# Altium project AMS_A2_Sample.PrjPcb
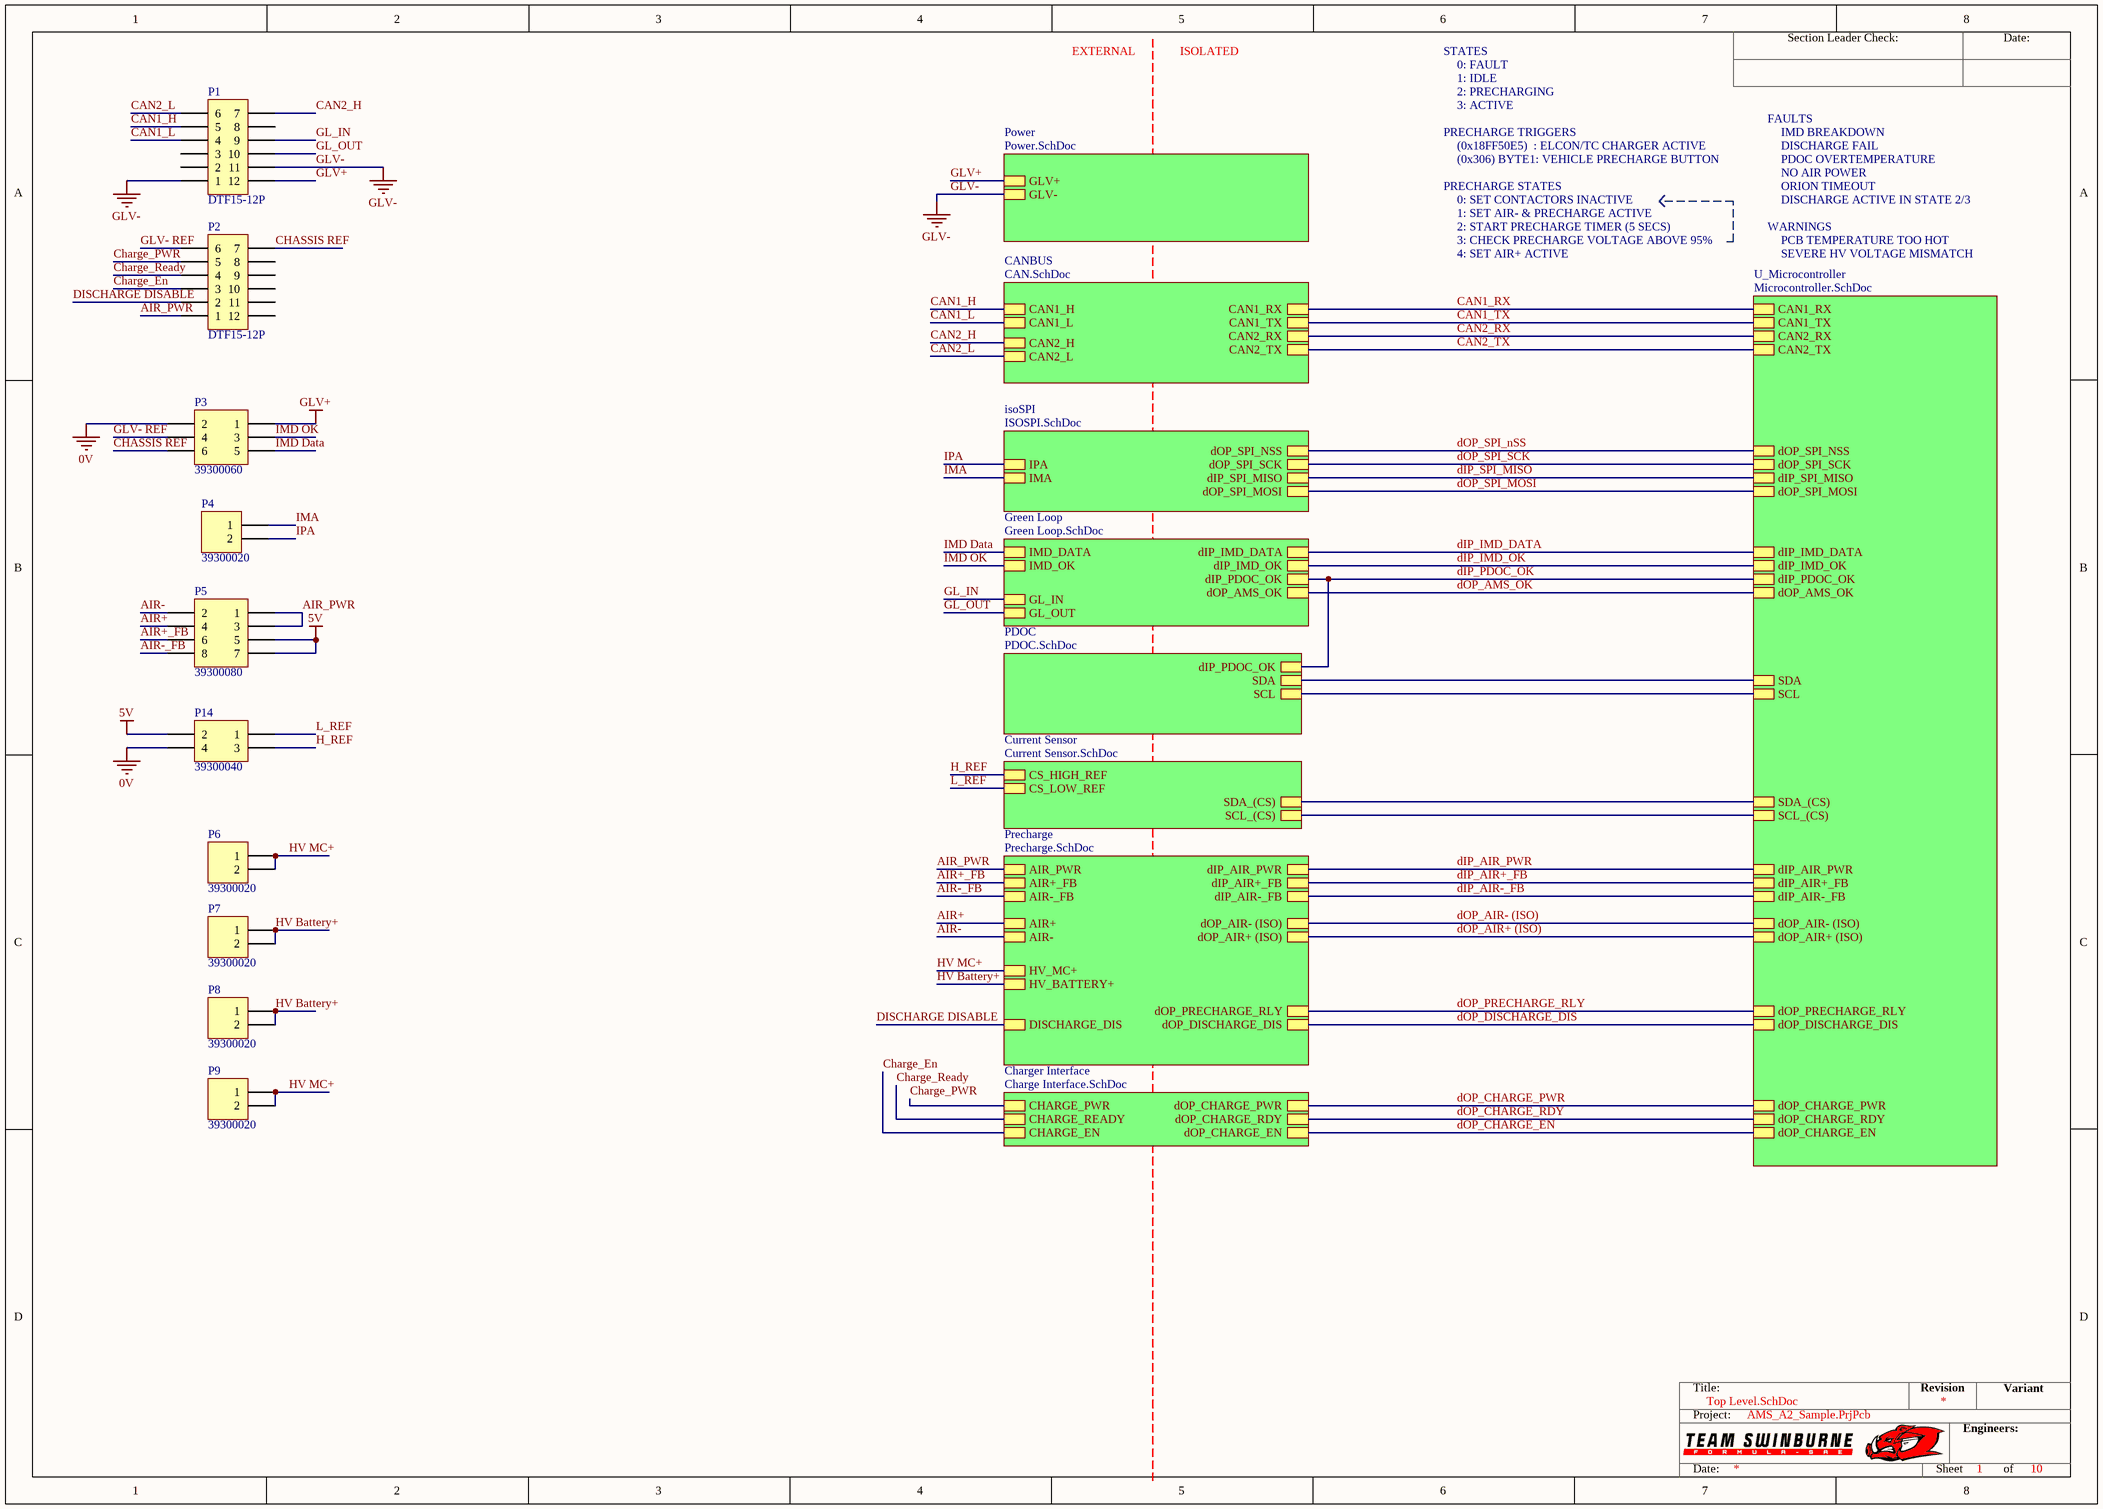
[diagram p0: Top Level.SchDoc]
7 sheets, 159 parts. Net scope: hierarchical (ports join the sheet entries above them; power ports are global).
Board file: AMS_A2_Sample.PcbDoc
Sheets:
  Top Level.SchDoc
    U_Microcontroller = Microcontroller.SchDoc
    PDOC = PDOC.SchDoc
    Precharge = Precharge.SchDoc
    Charger Interface = Charge Interface.SchDoc
    Current Sensor = Current Sensor.SchDoc
    Power = Power.SchDoc

## Sheet Top Level.SchDoc
size A3; SheetNumber: 1; SheetTotal: 10

### Parts
P1  DTF15-12P  [DTF15-12P]
P2  DTF15-12P  [DTF15-12P]
P3  39300060  [39300060]
P4  39300020  [39300020]
P5  39300080  [39300080]
P6  39300020  [39300020]
P7  39300020  [39300020]
P8  39300020  [39300020]
P9  39300020  [39300020]
P14  39300040  [39300040]

### Sub-sheets
CANBUS = CAN.SchDoc (file not in this document): CAN1_RX, CAN1_TX, CAN2_RX, CAN2_TX, CAN1_H, CAN1_L, CAN2_H, CAN2_L
Charger Interface = Charge Interface.SchDoc: dOP_CHARGE_PWR, dOP_CHARGE_RDY, dOP_CHARGE_EN, CHARGE_PWR, CHARGE_READY, CHARGE_EN
Current Sensor = Current Sensor.SchDoc: SCL_(CS), CS_HIGH_REF, CS_LOW_REF, SDA_(CS)
Green Loop = Green Loop.SchDoc (file not in this document): dIP_IMD_DATA, dIP_IMD_OK, dIP_PDOC_OK, dOP_AMS_OK, IMD_DATA, IMD_OK, GL_IN, GL_OUT
isoSPI = ISOSPI.SchDoc (file not in this document): dOP_SPI_NSS, dOP_SPI_SCK, dIP_SPI_MISO, dOP_SPI_MOSI, IPA, IMA
PDOC = PDOC.SchDoc: dIP_PDOC_OK, SDA, SCL
Power = Power.SchDoc: GLV+, GLV-
Precharge = Precharge.SchDoc: dIP_AIR_PWR, dIP_AIR+_FB, dIP_AIR-_FB, dOP_AIR- (ISO), dOP_AIR+ (ISO), dOP_PRECHARGE_RLY, dOP_DISCHARGE_DIS, DISCHARGE_DIS, AIR+, AIR-, AIR_PWR, AIR+_FB, AIR-_FB, HV_MC+, HV_BATTERY+
U_Microcontroller = Microcontroller.SchDoc: CAN1_RX, CAN1_TX, dOP_SPI_NSS, CAN2_RX, CAN2_TX, dOP_SPI_SCK, dIP_SPI_MISO, dOP_SPI_MOSI, dIP_IMD_DATA, dIP_IMD_OK, dIP_PDOC_OK, dOP_AMS_OK, dIP_AIR_PWR, dIP_AIR+_FB, dIP_AIR-_FB, dOP_AIR- (ISO), dOP_AIR+ (ISO), dOP_PRECHARGE_RLY, dOP_DISCHARGE_DIS, dOP_CHARGE_PWR, dOP_CHARGE_RDY, dOP_CHARGE_EN, SDA, SCL, SDA_(CS), SCL_(CS)

### Nets
0V: P3.2 P14.4
5V: P5.5 P5.7 P14.2
GLV+: P1.12 P3.1 ; sheet Power/GLV+
GLV-: P1.1 P1.11 ; sheet Power/GLV-
AIR+: P5.4 ; sheet Precharge/AIR+
AIR+_FB: P5.6 ; sheet Precharge/AIR+_FB
AIR-: P5.2 ; sheet Precharge/AIR-
AIR-_FB: P5.8 ; sheet Precharge/AIR-_FB
AIR_PWR: P2.1 P5.1 P5.3 ; sheet Precharge/AIR_PWR
CAN1_H: P1.5 ; sheet CANBUS/CAN1_H
CAN1_L: P1.4 ; sheet CANBUS/CAN1_L
CAN1_RX: sheet U_Microcontroller/CAN1_RX, sheet CANBUS/CAN1_RX
CAN1_TX: sheet U_Microcontroller/CAN1_TX, sheet CANBUS/CAN1_TX
CAN2_H: P1.7 ; sheet CANBUS/CAN2_H
CAN2_L: P1.6 ; sheet CANBUS/CAN2_L
CAN2_RX: sheet U_Microcontroller/CAN2_RX, sheet CANBUS/CAN2_RX
CAN2_TX: sheet U_Microcontroller/CAN2_TX, sheet CANBUS/CAN2_TX
Charge_En: P2.3 ; sheet Charger Interface/CHARGE_EN
Charge_PWR: P2.5 ; sheet Charger Interface/CHARGE_PWR
Charge_Ready: P2.4 ; sheet Charger Interface/CHARGE_READY
CHASSIS REF: P2.7 P3.6
dIP_AIR+_FB: sheet U_Microcontroller/dIP_AIR+_FB, sheet Precharge/dIP_AIR+_FB
dIP_AIR-_FB: sheet U_Microcontroller/dIP_AIR-_FB, sheet Precharge/dIP_AIR-_FB
dIP_AIR_PWR: sheet U_Microcontroller/dIP_AIR_PWR, sheet Precharge/dIP_AIR_PWR
dIP_IMD_DATA: sheet U_Microcontroller/dIP_IMD_DATA, sheet Green Loop/dIP_IMD_DATA
dIP_IMD_OK: sheet U_Microcontroller/dIP_IMD_OK, sheet Green Loop/dIP_IMD_OK
dIP_PDOC_OK: sheet U_Microcontroller/dIP_PDOC_OK, sheet Green Loop/dIP_PDOC_OK, sheet PDOC/dIP_PDOC_OK
dIP_SPI_MISO: sheet U_Microcontroller/dIP_SPI_MISO, sheet isoSPI/dIP_SPI_MISO
DISCHARGE DISABLE: P2.2 ; sheet Precharge/DISCHARGE_DIS
dOP_AIR+ (ISO): sheet U_Microcontroller/dOP_AIR+ (ISO), sheet Precharge/dOP_AIR+ (ISO)
dOP_AIR- (ISO): sheet U_Microcontroller/dOP_AIR- (ISO), sheet Precharge/dOP_AIR- (ISO)
dOP_AMS_OK: sheet U_Microcontroller/dOP_AMS_OK, sheet Green Loop/dOP_AMS_OK
dOP_CHARGE_EN: sheet U_Microcontroller/dOP_CHARGE_EN, sheet Charger Interface/dOP_CHARGE_EN
dOP_CHARGE_PWR: sheet U_Microcontroller/dOP_CHARGE_PWR, sheet Charger Interface/dOP_CHARGE_PWR
dOP_CHARGE_RDY: sheet U_Microcontroller/dOP_CHARGE_RDY, sheet Charger Interface/dOP_CHARGE_RDY
dOP_DISCHARGE_DIS: sheet U_Microcontroller/dOP_DISCHARGE_DIS, sheet Precharge/dOP_DISCHARGE_DIS
dOP_PRECHARGE_RLY: sheet U_Microcontroller/dOP_PRECHARGE_RLY, sheet Precharge/dOP_PRECHARGE_RLY
dOP_SPI_MOSI: sheet U_Microcontroller/dOP_SPI_MOSI, sheet isoSPI/dOP_SPI_MOSI
dOP_SPI_nSS: sheet U_Microcontroller/dOP_SPI_NSS, sheet isoSPI/dOP_SPI_NSS
dOP_SPI_SCK: sheet U_Microcontroller/dOP_SPI_SCK, sheet isoSPI/dOP_SPI_SCK
GL_IN: P1.9 ; sheet Green Loop/GL_IN
GL_OUT: P1.10 ; sheet Green Loop/GL_OUT
GLV- REF: P2.6 P3.4
H_REF: P14.3 ; sheet Current Sensor/CS_HIGH_REF
HV Battery+: P7.1 P7.2 P8.1 P8.2 ; sheet Precharge/HV_BATTERY+
HV MC+: P6.1 P6.2 P9.1 P9.2 ; sheet Precharge/HV_MC+
I2C1_SCL: sheet U_Microcontroller/SCL, sheet PDOC/SCL
I2C1_SDA: sheet U_Microcontroller/SDA, sheet PDOC/SDA
I2C3_SCL: sheet U_Microcontroller/SCL_(CS), sheet Current Sensor/SCL_(CS)
I2C3_SDA: sheet U_Microcontroller/SDA_(CS), sheet Current Sensor/SDA_(CS)
IMA: P4.1 ; sheet isoSPI/IMA
IMD Data: P3.5 ; sheet Green Loop/IMD_DATA
IMD OK: P3.3 ; sheet Green Loop/IMD_OK
IPA: P4.2 ; sheet isoSPI/IPA
L_REF: P14.1 ; sheet Current Sensor/CS_LOW_REF

Not connected (* = marked no-connect by the designer): P1 2 3 8; P2 8 9 10 11 12

### Notes on the sheet
- EXTERNAL
- ISOLATED
- STATES
- 0: FAULT
- 1: IDLE
- 2: PRECHARGING
- 3: ACTIVE
- PRECHARGE TRIGGERS
- (0x18FF50E5)  : ELCON/TC CHARGER ACTIVE
- (0x306) BYTE1: VEHICLE PRECHARGE BUTTON
- FAULTS
- IMD BREAKDOWN
- DISCHARGE FAIL
- PDOC OVERTEMPERATURE
- NO AIR POWER
- PRECHARGE STATES
- 1: SET AIR- & PRECHARGE ACTIVE
- 2: START PRECHARGE TIMER (5 SECS)
- 3: CHECK PRECHARGE VOLTAGE ABOVE 95%
- 0: SET CONTACTORS INACTIVE
- WARNINGS
- PCB TEMPERATURE TOO HOT
- ORION TIMEOUT
- DISCHARGE ACTIVE IN STATE 2/3
- 4: SET AIR+ ACTIVE
- SEVERE HV VOLTAGE MISMATCH
- Section Leader Check:
- Date:
- Title:
- Revision
- Variant
- Project:
- Engineers:
- Sheet
- of

### Library data of the parts
P1 P2 = DTF15-12P: Positions: 12; Pitch: 4.44mm; Row Spacing: 9.12 mm; Angle: 0; Flange: No; Contact: Copper Alloy; Part Number: DTF15-12P; Digikey Part Number: 1734-1647-ND; Digikey Link: https://www.digikey.com.au/product-detail/en/te-connectivity-deutsch-connectors/DTF15-12PA/1734-1647-ND/7220164
P3 = 39300060: Pitch: 4.2mm; Row Spacing: 5.5mm; Angle: 90; Flange: No; Contact: Tin; Part Number: 39300060; Positions: 6; Digikey Part Number: WM21353-ND
P4 P6-P9 = 39300020: Pitch: 4.2mm; Row Spacing: 5.5mm; Angle: 90; Flange: No; Contact: Tin; Part Number: 39300020; Positions: 2; Digikey Part Number: WM21351-ND
P5 = 39300080: Pitch: 4.2mm; Row Spacing: 5.5mm; Angle: 90; Flange: No; Contact: Tin; Part Number: 39300080; Positions: 8; Digikey Part Number: WM21354-ND
P14 = 39300040: Pitch: 4.2mm; Row Spacing: 5.5mm; Angle: 90; Flange: No; Contact: Tin; Part Number: 39300040; Positions: 4; Digikey Part Number: WM21352-ND

## Sheet Microcontroller.SchDoc
size A4; SheetNumber: 10; SheetTotal: 10
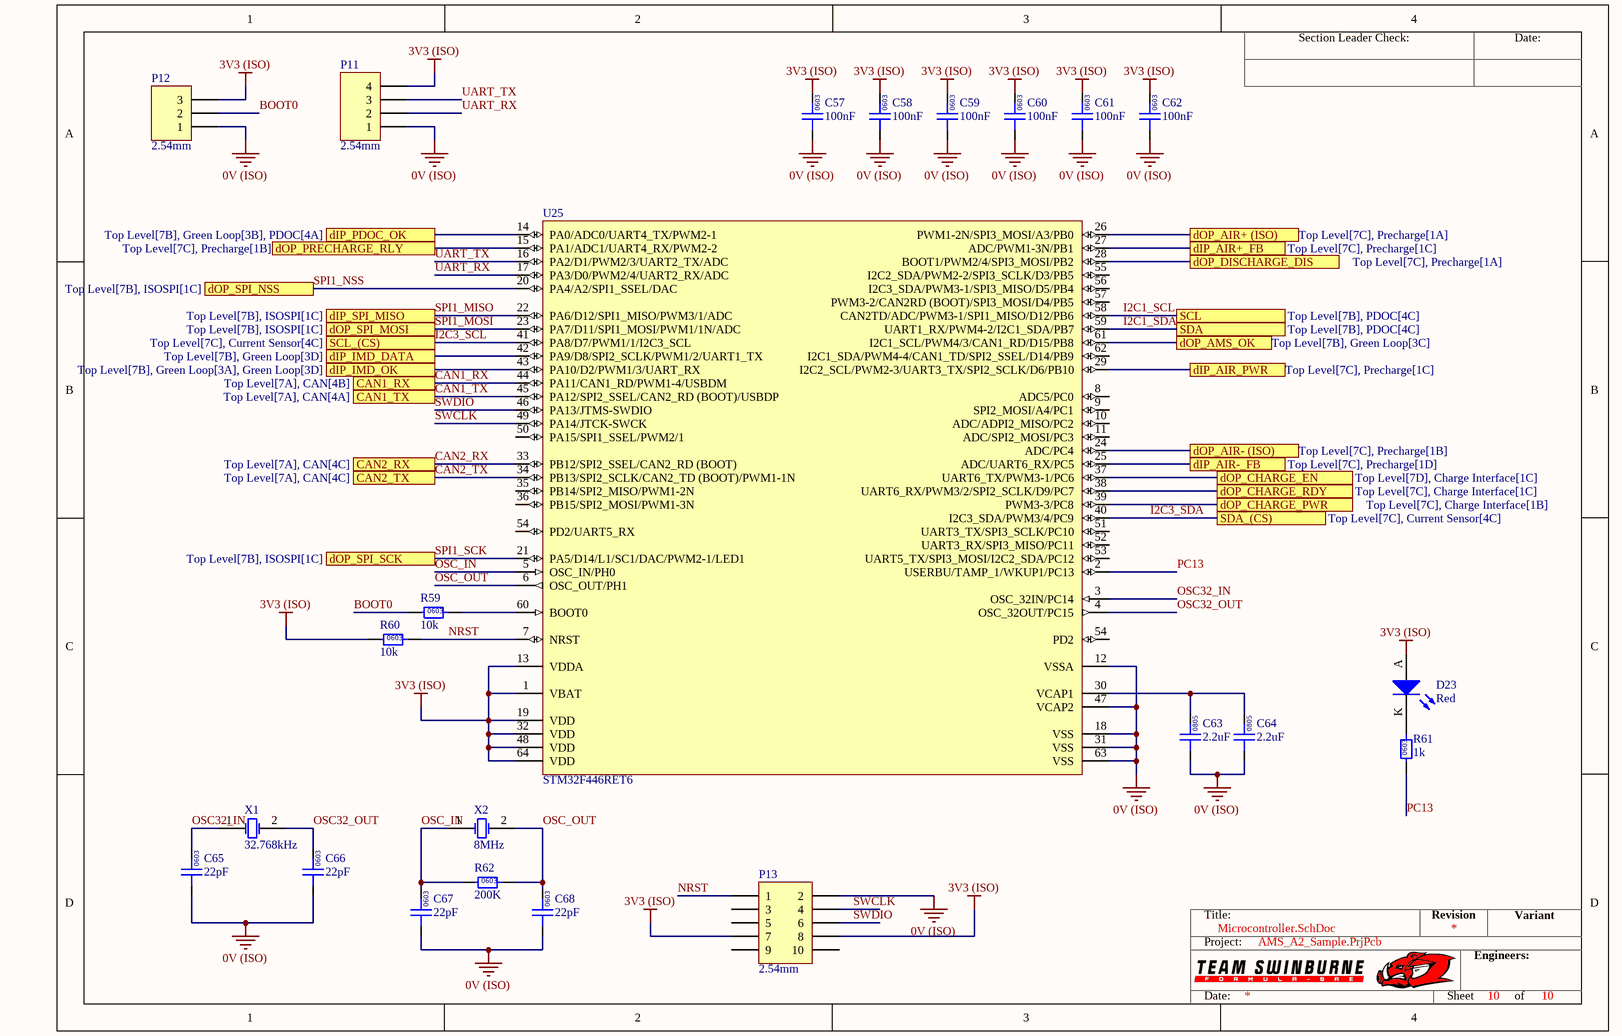
[diagram p1: Microcontroller.SchDoc]

### Parts
C57  100nF  [0603]
C58  100nF  [0603]
C59  100nF  [0603]
C60  100nF  [0603]
C61  100nF  [0603]
C62  100nF  [0603]
C63  2.2uF  [0805]
C64  2.2uF  [0805]
C65  22pF  [0603]
C66  22pF  [0603]
C67  22pF  [0603]
C68  22pF  [0603]
D23  Red  [0805 LED]
P11  2.54mm  [TH 2.54mm Header 1x4]
P12  2.54mm  [TH 2.54mm Header 1x3]
P13  2.54mm  [TH 2.54mm Header 2x5]
R59  10k  [0603]
R60  10k  [0603]
R61  1k  [0603]
R62  200K  [0603]
U25  STM32F446RET6  [STM 64-LQFP]
X1  32.768kHz  [EPSON 2-SMD]
X2  8MHz  [ECS-80-18-30-JGN-TR]

### Ports
CAN1_RX (see Top Level[7A], CAN[4B]), CAN1_TX (see Top Level[7A], CAN[4A]), CAN2_RX (see Top Level[7A], CAN[4C]), CAN2_TX (see Top Level[7A], CAN[4C]), dIP_AIR+_FB (see Top Level[7C], Precharge[1C]), dIP_AIR-_FB (see Top Level[7C], Precharge[1D]), dIP_AIR_PWR (see Top Level[7C], Precharge[1C]), dIP_IMD_DATA (see Top Level[7B], Green Loop[3D]), dIP_IMD_OK (see Top Level[7B], Green Loop[3A], Green Loop[3D]), dIP_PDOC_OK (see Top Level[7B], Green Loop[3B], PDOC[4A]), dIP_SPI_MISO (see Top Level[7B], ISOSPI[1C]), dOP_AIR+ (ISO) (see Top Level[7C], Precharge[1A]), dOP_AIR- (ISO) (see Top Level[7C], Precharge[1B]), dOP_AMS_OK (see Top Level[7B], Green Loop[3C]), dOP_CHARGE_EN (see Top Level[7D], Charge Interface[1C]), dOP_CHARGE_PWR (see Top Level[7C], Charge Interface[1B]), dOP_CHARGE_RDY (see Top Level[7C], Charge Interface[1C]), dOP_DISCHARGE_DIS (see Top Level[7C], Precharge[1A]), dOP_PRECHARGE_RLY (see Top Level[7C], Precharge[1B]), dOP_SPI_MOSI (see Top Level[7B], ISOSPI[1C]), dOP_SPI_NSS (see Top Level[7B], ISOSPI[1C]), dOP_SPI_SCK (see Top Level[7B], ISOSPI[1C]), SCL (see Top Level[7B], PDOC[4C]), SCL_(CS) (see Top Level[7C], Current Sensor[4C]), SDA (see Top Level[7B], PDOC[4C]), SDA_(CS) (see Top Level[7C], Current Sensor[4C])

### Nets
0V (ISO): C57.1 C58.1 C59.1 C60.1 C61.1 C62.1 C63.1 C64.1 C65.1 C66.1 C67.1 C68.1 P11.1 P12.1 P13.2 U25.12(VSSA) U25.18(VSS) U25.31(VSS) U25.47(VCAP2) U25.63(VSS)
3V3 (ISO): C57.2 C58.2 C59.2 C60.2 C61.2 C62.2 D23.A P11.4 P12.3 P13.7 P13.8 R60.1 U25.1(VBAT) U25.13(VDDA) U25.19(VDD) U25.32(VDD) U25.48(VDD) U25.64(VDD)
BOOT0: P12.2 R59.1
CAN1_RX: U25.44(PA11/CAN1_RD/PWM1-4/USBDM) ; port CAN1_RX
CAN1_TX: U25.45(PA12/SPI2_SSEL/CAN2_RD_(BOOT)/USBDP) ; port CAN1_TX
CAN2_RX: U25.33(PB12/SPI2_SSEL/CAN2_RD_(BOOT)) ; port CAN2_RX
CAN2_TX: U25.34(PB13/SPI2_SCLK/CAN2_TD_(BOOT)/PWM1-1N) ; port CAN2_TX
dIP_AIR+_FB: U25.27(ADC/PWM1-3N/PB1) ; port dIP_AIR+_FB
dIP_AIR-_FB: U25.25(ADC/UART6_RX/PC5) ; port dIP_AIR-_FB
dIP_AIR_PWR: U25.29(I2C2_SCL/PWM2-3/UART3_TX/SPI2_SCLK/D6/PB10) ; port dIP_AIR_PWR
dIP_IMD_DATA: U25.42(PA9/D8/SPI2_SCLK/PWM1/2/UART1_TX) ; port dIP_IMD_DATA
dIP_IMD_OK: U25.43(PA10/D2/PWM1/3/UART_RX) ; port dIP_IMD_OK
dIP_PDOC_OK: U25.14(PA0/ADC0/UART4_TX/PWM2-1) ; port dIP_PDOC_OK
dOP_AIR+ (ISO): U25.26(PWM1-2N/SPI3_MOSI/A3/PB0) ; port dOP_AIR+ (ISO)
dOP_AIR- (ISO): U25.24(ADC/PC4) ; port dOP_AIR- (ISO)
dOP_AMS_OK: U25.61(I2C1_SCL/PWM4/3/CAN1_RD/D15/PB8) ; port dOP_AMS_OK
dOP_CHARGE_EN: U25.37(UART6_TX/PWM3-1/PC6) ; port dOP_CHARGE_EN
dOP_CHARGE_PWR: U25.39(PWM3-3/PC8) ; port dOP_CHARGE_PWR
dOP_CHARGE_RDY: U25.38(UART6_RX/PWM3/2/SPI2_SCLK/D9/PC7) ; port dOP_CHARGE_RDY
dOP_DISCHARGE_DIS: U25.28(BOOT1/PWM2/4/SPI3_MOSI/PB2) ; port dOP_DISCHARGE_DIS
dOP_PRECHARGE_RLY: U25.15(PA1/ADC1/UART4_RX/PWM2-2) ; port dOP_PRECHARGE_RLY
I2C1_SCL: U25.58(CAN2TD/ADC/PWM3-1/SPI1_MISO/D12/PB6) ; port SCL
I2C1_SDA: U25.59(UART1_RX/PWM4-2/I2C1_SDA/PB7) ; port SDA
I2C3_SCL: U25.41(PA8/D7/PWM1/1/I2C3_SCL) ; port SCL_(CS)
I2C3_SDA: U25.40(I2C3_SDA/PWM3/4/PC9) ; port SDA_(CS)
NRST: P13.1 R60.2 U25.7(NRST)
OSC32_IN: C65.2 U25.3(OSC_32IN/PC14) X1.1(OSC1)
OSC32_OUT: C66.2 U25.4(OSC_32OUT/PC15) X1.2(OSC2)
OSC_IN: C67.2 R62.1 U25.5(OSC_IN/PH0) X2.1(OSC1)
OSC_OUT: C68.2 R62.2 U25.6(OSC_OUT/PH1) X2.2(OSC2)
PC13: R61.1 U25.2(USERBU/TAMP_1/WKUP1/PC13)
SPI1_MISO: U25.22(PA6/D12/SPI1_MISO/PWM3/1/ADC) ; port dIP_SPI_MISO  [project net dIP_SPI_MISO]
SPI1_MOSI: U25.23(PA7/D11/SPI1_MOSI/PWM1/1N/ADC) ; port dOP_SPI_MOSI  [project net dOP_SPI_MOSI]
SPI1_NSS: U25.20(PA4/A2/SPI1_SSEL/DAC) ; port dOP_SPI_NSS  [project net dOP_SPI_nSS]
SPI1_SCK: U25.21(PA5/D14/L1/SC1/DAC/PWM2-1/LED1) ; port dOP_SPI_SCK  [project net dOP_SPI_SCK]
SWCLK: P13.4 U25.49(PA14/JTCK-SWCK)
SWDIO: P13.6 U25.46(PA13/JTMS-SWDIO)
UART_RX: P11.2 U25.17(PA3/D0/PWM2/4/UART2_RX/ADC)
UART_TX: P11.3 U25.16(PA2/D1/PWM2/3/UART2_TX/ADC)
NetC63_2: C63.2 C64.2 U25.30(VCAP1)
NetD23_K: D23.K R61.2
NetR59_2: R59.2 U25.60(BOOT0)

Not connected (* = marked no-connect by the designer): P13 3 5 9 10; U25 8(ADC5/PC0) 9(SPI2_MOSI/A4/PC1) 10(ADC/ADPI2_MISO/PC2) 11(ADC/SPI2_MOSI/PC3) 35(PB14/SPI2_MISO/PWM1-2N) 36(PB15/SPI2_MOSI/PWM1-3N) 50(PA15/SPI1_SSEL/PWM2/1) 51(UART3_TX/SPI3_SCLK/PC10) 52(UART3_RX/SPI3_MISO/PC11) 53(UART5_TX/SPI3_MOSI/I2C2_SDA/PC12) 54(PD2) 55(I2C2_SDA/PWM2-2/SPI3_SCLK/D3/PB5) 56(I2C3_SDA/PWM3-1/SPI3_MISO/D5/PB4) 57(PWM3-2/CAN2RD_(BOOT)/SPI3_MOSI/D4/PB5) 62(I2C1_SDA/PWM4-4/CAN1_TD/SPI2_SSEL/D14/PB9)

### Notes on the sheet
- Section Leader Check:
- Date:
- Title:
- Revision
- Variant
- Project:
- Engineers:
- Sheet
- of
- (in symbol GCM188L81H104KA57D) 0603
- (in symbol GRM21BR71E225KE11L) 0805
- (in symbol GRM0335C1H220JA01D) 0603
- (in symbol RC0603FR-071KL) 0603
- (in symbol RC0603FR-0710KL) 0603
- (in symbol RC0603FR-0720KL) 0603

### Library data of the parts
C57-C62 = GCM188L81H104KA57D: Manufacturer: muRata; Rated Voltage: 50V; Tolerance: ±10%; Material: MLCC; Temperature Rating: X8L; Part Number: GCM188L81H104KA57D; Value: 100nF; Digikey Part Number: 490-6049-1-ND
C63 C64 = GRM21BR71E225KE11L: Manufacturer: Murata Electronics; Rated Voltage: 25V; Tolerance: ±10%; Material: MLCC; Temperature Rating: X7R; Part Number: GRM21BR71E225KE11L; Value: 2.2uF; Digikey Part Number: 490-14467-2-ND
C65-C68 = GRM0335C1H220JA01D: Manufacturer: Murata Electronics; Rated Voltage: 50V; Tolerance: ±5%; Material: MLCC; Temperature Rating: C0G, NP0; Part Number: GRM0335C1H220JA01D; Value: 22pF; Digikey Part Number: 490-6123-1-ND
D23 = SML-210LTT86: Red LED Indication - Discrete 1.75V 0805 (2012 Metric); Manufacturer: ROHM Semiconductor; Part Number: SML-210LTT86; Colour: Red; Digikey Part Number: 511-1286-1-ND; Digikey Link: https://www.digikey.com/product-detail/en/rohm-semiconductor/SML-210LTT86/511-1286-1-ND/637099
P11 = TH 2.54mm Header 1x4: Positions: 4; Angle: 0; Flange: No; Contact: NA; Part Number: TH 2.54mm Header 1x4; Pitch: 2.54mm; Row Spacing: 2.54mm
P12 = TH 2.54mm Header 1x3: Positions: 3; Angle: 0; Flange: No; Contact: NA; Part Number: TH 2.54mm Header 1x3; Pitch: 2.54mm; Row Spacing: 2.54mm
P13 = SMD 2.54mm Header 2x5: Positions: 10; Angle: 0; Flange: No; Contact: NA; Part Number: SMD 2.54mm Header 2x5; Pitch: 2.54mm; Row Spacing: 2.54mm
R59 R60 = RC0603FR-0710KL: Manufacturer: YAGEO; Tolerance: 0.01; Rated Power: 0.1W; Part Number: RC0603FR-0710KL; Value: 10k; Material: FR-07; Digikey Part Number: 311-10.0KHRCT-ND
R61 = RC0603FR-071KL: Manufacturer: YAGEO; Tolerance: 0.01; Rated Power: 0.1W; Part Number: RC0603FR-071KL; Value: 1k; Material: FR-07; Digikey Part Number: 311-1.00KHRCT-ND
R62 = RC0603FR-0720KL: Manufacturer: YAGEO; Value: 20K; Tolerance: 0.01; Rated Power: 0.1W; Part Number: RC0603FR-0720KL; Material: FR-07; Digikey Part Number: 311-20.0KHRCT-ND
U25 = STM32F446RET6: ARM® Cortex®-M4 STM32F4 Microcontroller IC 32-Bit 180MHz 512KB (512K x 8) FLASH 64-LQFP (10x10); Manufacturer: STMicroelectronics; Part Number: STM32F446RET6; Digikey Part Number: 497-15376-ND; Digikey Link: https://www.digikey.com.au/product-detail/en/stmicroelectronics/STM32F446RET6/497-15376-ND/5175962
X1 = FC-135 32.7680KA-A5: Manufacturer: EPSON; Load Capacitance: 12.5pF; ESR: 70k; Part Number: FC-135 32.7680KA-A5; Value: 32.768kHz; Digikey Part Number: SER4103TR-ND; Digikey Link: https://www.digikey.com/product-detail/en/epson/FC-135-32.7680KA-A5/SER4103TR-ND/5259895
X2 = ECS-80-18-30-JGN-TR: Manufacturer: ECS Inc; Load Capacitance: 18pF; ESR: 100R; Part Number: ECS-80-18-30-JGN-TR; Value: 8MHz; Digikey Part Number: XC2103CT-ND; Digikey Link: https://www.digikey.com/en/products/detail/ecs-inc/ECS-80-18-30-JGN-TR/5875530

## Sheet PDOC.SchDoc
size A4; SheetNumber: 6; SheetTotal: 10
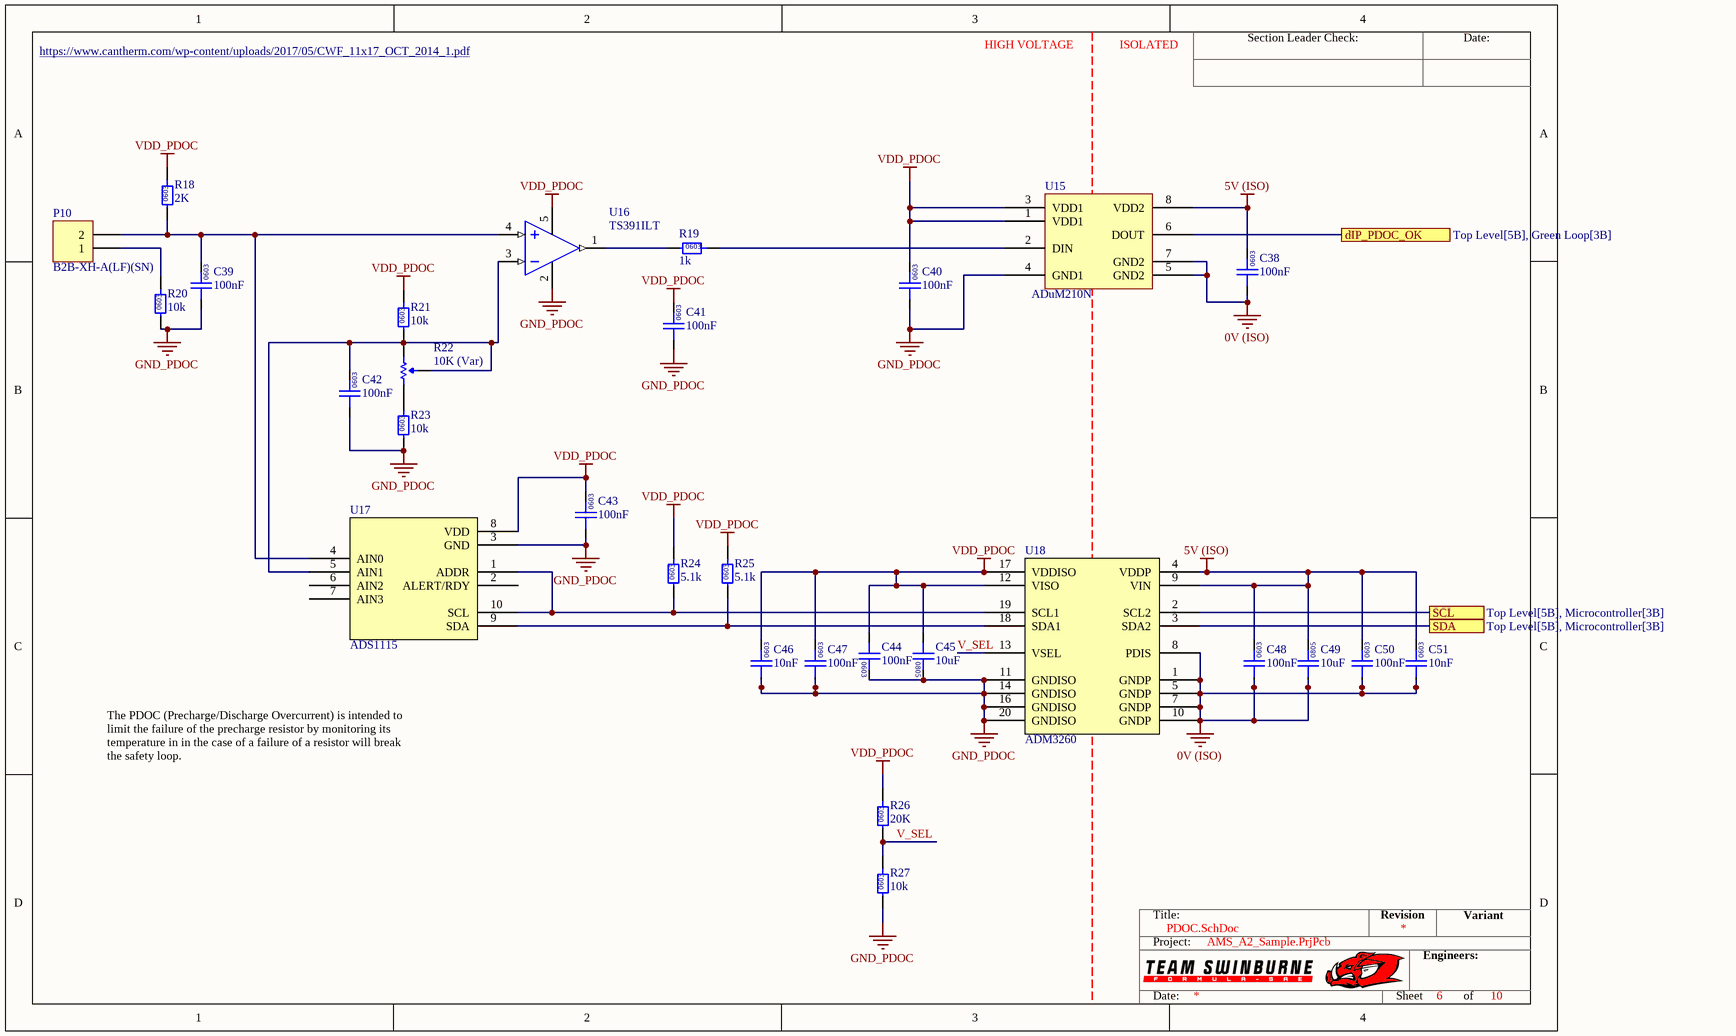
[diagram p2: PDOC.SchDoc]

### Parts
C38  100nF  [0603]
C39  100nF  [0603]
C40  100nF  [0603]
C41  100nF  [0603]
C42  100nF  [0603]
C43  100nF  [0603]
C44  100nF  [0603]
C45  10uF  [0805]
C46  10nF  [0603]
C47  100nF  [0603]
C48  100nF  [0603]
C49  10uF  [0805]
C50  100nF  [0603]
C51  10nF  [0603]
P10  B2B-XH-A(LF)(SN)  [XH 2 PIN VERT]
R18  2K  [0603]
R19  1k  [0603]
R20  10k  [0603]
R21  10k  [0603]
R22  10K (Var)  [B 3296]
R23  10k  [0603]
R24  5.1k  [0603]
R25  5.1k  [0603]
R26  20K  [0603]
R27  10k  [0603]
U15  ADuM210N  [SOIC-8W]
U16  TS391ILT  [ON SOT-23-5]
U17  ADS1115  [TI 10-VSSOP]
U18  ADM3260  [AD 20-SSOP]

### Ports
dIP_PDOC_OK (see Top Level[5B], Green Loop[3B]), SCL (see Top Level[5B], Microcontroller[3B]), SDA (see Top Level[5B], Microcontroller[3B])

### Nets
0V (ISO): C38.1 C48.1 C49.1 C50.1 C51.1 U15.5(GND2) U15.7(GND2) U18.1(GNDP) U18.5(GNDP) U18.7(GNDP) U18.8(PDIS) U18.10(GNDP)
5V (ISO): C38.2 C48.2 C49.2 C50.2 C51.2 U15.8(VDD2) U18.4(VDDP) U18.9(VIN)
GND_PDOC: C39.1 C40.1 C41.1 C42.1 C43.1 C44.2 C45.2 C46.1 C47.1 R20.1 R23.1 R27.1 U15.4(GND1) U16.2(VCC-) U17.3(GND) U18.11(GNDISO) U18.14(GNDISO) U18.16(GNDISO) U18.20(GNDISO)
VDD_PDOC: C40.2 C41.2 C43.2 C44.1 C45.1 C46.2 C47.2 R18.2 R21.2 R24.2 R25.2 R26.2 U15.1(VDD1) U15.3(VDD1) U16.5(VCC+) U17.8(VDD) U18.12(VISO) U18.17(VDDISO)
dIP_PDOC_OK: U15.6(DOUT) ; port dIP_PDOC_OK
I2C1_SCL: U18.2(SCL2) ; port SCL
I2C1_SDA: U18.3(SDA2) ; port SDA
V_SEL: R26.1 R27.2 U18.13(VSEL)
NetC39_2: C39.2 P10.2 R18.1 U16.4(IIN+) U17.4(AIN0)
NetC42_2: C42.2 R21.1 R22.1(CCW) R22.2(Wiper) U16.3(IN-) U17.5(AIN1)
NetP10_1: P10.1 R20.2
NetR19_1: R19.1 U16.1(OUT)
NetR19_2: R19.2 U15.2(DIN)
NetR22_3: R22.3(CW) R23.2
NetR24_1: R24.1 U17.1(ADDR) U17.10(SCL) U18.19(SCL1)
NetR25_1: R25.1 U17.9(SDA) U18.18(SDA1)

Not connected (* = marked no-connect by the designer): U17 2(ALERT/RDY) 6(AIN2) 7(AIN3)

### Notes on the sheet
- https://www.cantherm.com/wp-content/uploads/2017/05/CWF_11x17_OCT_2014_1.pdf
- HIGH VOLTAGE
- ISOLATED
- The PDOC (Precharge/Discharge Overcurrent) is intended to limit the failure of the precharge resistor by monitoring its temperature in in the case of a failure of a resistor will break the safety loop.
- Section Leader Check:
- Date:
- Title:
- Revision
- Variant
- Project:
- Engineers:
- Sheet
- of
- (in symbol GCM188L81H103KA03D) 0603
- (in symbol GCM188L81H104KA57D) 0603
- (in symbol GRM21BR6YA106KE43L) 0805
- (in symbol RC0603FR-071KL) 0603
- (in symbol RC0603FR-072KL) 0603
- (in symbol RC0603FR-0710KL) 0603
- (in symbol RC0603FR-0720KL) 0603
- (in symbol RC0603JR-075K1L) 0603

### Library data of the parts
C38-C44 C47 C48 C50 = GCM188L81H104KA57D: as C57 on sheet Microcontroller; Part Number: GCM188L81H104KA57D; Value: 100nF; Digikey Part Number: 490-6049-1-ND
C45 C49 = GRM21BR6YA106KE43L: Manufacturer: muRata; Rated Voltage: 50V; Tolerance: 10%; Material: MLCC; Temperature Rating: X5R; Part Number: GRM21BR6YA106KE43L; Value: 10uF; Digikey Part Number: 490-10514-6-ND
C46 C51 = GCM188L81H103KA03D: Manufacturer: muRata; Rated Voltage: 50V; Tolerance: ±10%; Material: MLCC; Temperature Rating: X8L; Part Number: GCM188L81H103KA03D; Value: 10nF; Digikey Part Number: 490-GCM188L81H103KA03DCT-ND
P10 = B2B-XH-A(LF)(SN): Positions: 2; Pitch: 2.54mm; Angle: 0; Flange: No; Contact: Tin; Part Number: B2B-XH-A(LF)(SN); Row Spacing: 2.54mm; Digikey Part Number: 455-2247-ND; Digikey Link: https://www.digikey.com.au/en/products/detail/jst-sales-america-inc/B2B-XH-A-LF-SN/1651045
R18 = RC0603FR-072KL: Manufacturer: YAGEO; Tolerance: 0.01; Rated Power: 0.1W; Part Number: RC0603FR-072KL; Value: 2K; Digikey Part Number: 311-2.00KHRCT-ND; Material: FR-07
R19 = RC0603FR-071KL: as R61 on sheet Microcontroller; Part Number: RC0603FR-071KL; Value: 1k; Digikey Part Number: 311-1.00KHRCT-ND; Material: FR-07
R20 R21 R23 R27 = RC0603FR-0710KL: as R59 on sheet Microcontroller; Part Number: RC0603FR-0710KL; Value: 10k; Digikey Part Number: 311-10.0KHRCT-ND; Material: FR-07
R22 = 3296W-1-103LF: Manufacturer: Bournes Inc; Tolerance: 0.1; Rated Power: 0.5W; Part Number: 3296W-1-103LF; Value: 10K (Var); Digikey Part Number: 3296W-103LF-ND
R24 R25 = RC0603JR-075K1L: Manufacturer: YAGEO; Tolerance: 0.01; Rated Power: 0.1W; Part Number: RC0603JR-075K1L; Value: 5.1k; Material: FR-07; Digikey Part Number: 311-5.1KGRCT-ND
R26 = RC0603FR-0720KL: Manufacturer: YAGEO; Tolerance: 0.01; Rated Power: 0.1W; Part Number: RC0603FR-0720KL; Value: 20K; Digikey Part Number: 311-20.0KHRCT-ND; Material: FR-07
U15 = CMP-110-000007-1: DIGITAL ISOLATOR, SINGLE CHANNEL; Digikey Link: #https://www.analog.com/media/en/technical-documentation/data-sheets/ADuM210N.pdf#; Part Number: ADuM210N
U16 = CMP-022-000013-1: IC COMP LO PWR SGL V SOT 23-5L; Part Number: TS391ILT
U17 = ADS1115: 16 Bit Analog to Digital Converter 2, 4 Input 1 Sigma-Delta 10-VSSOP; Manufacturer: Texas Instruments; Part Number: ADS1115; Digikey Part Number: 296-38849-1-ND
U18 = CMP-021-000012-1: I²C Digital Isolator 2500Vrms 2 Channel 25kV/µs CMTI 20-SSOP (0.209", 5.30mm Width); Part Number: ADM3260

## Sheet Precharge.SchDoc
size A3; SheetNumber: 7; SheetTotal: 10
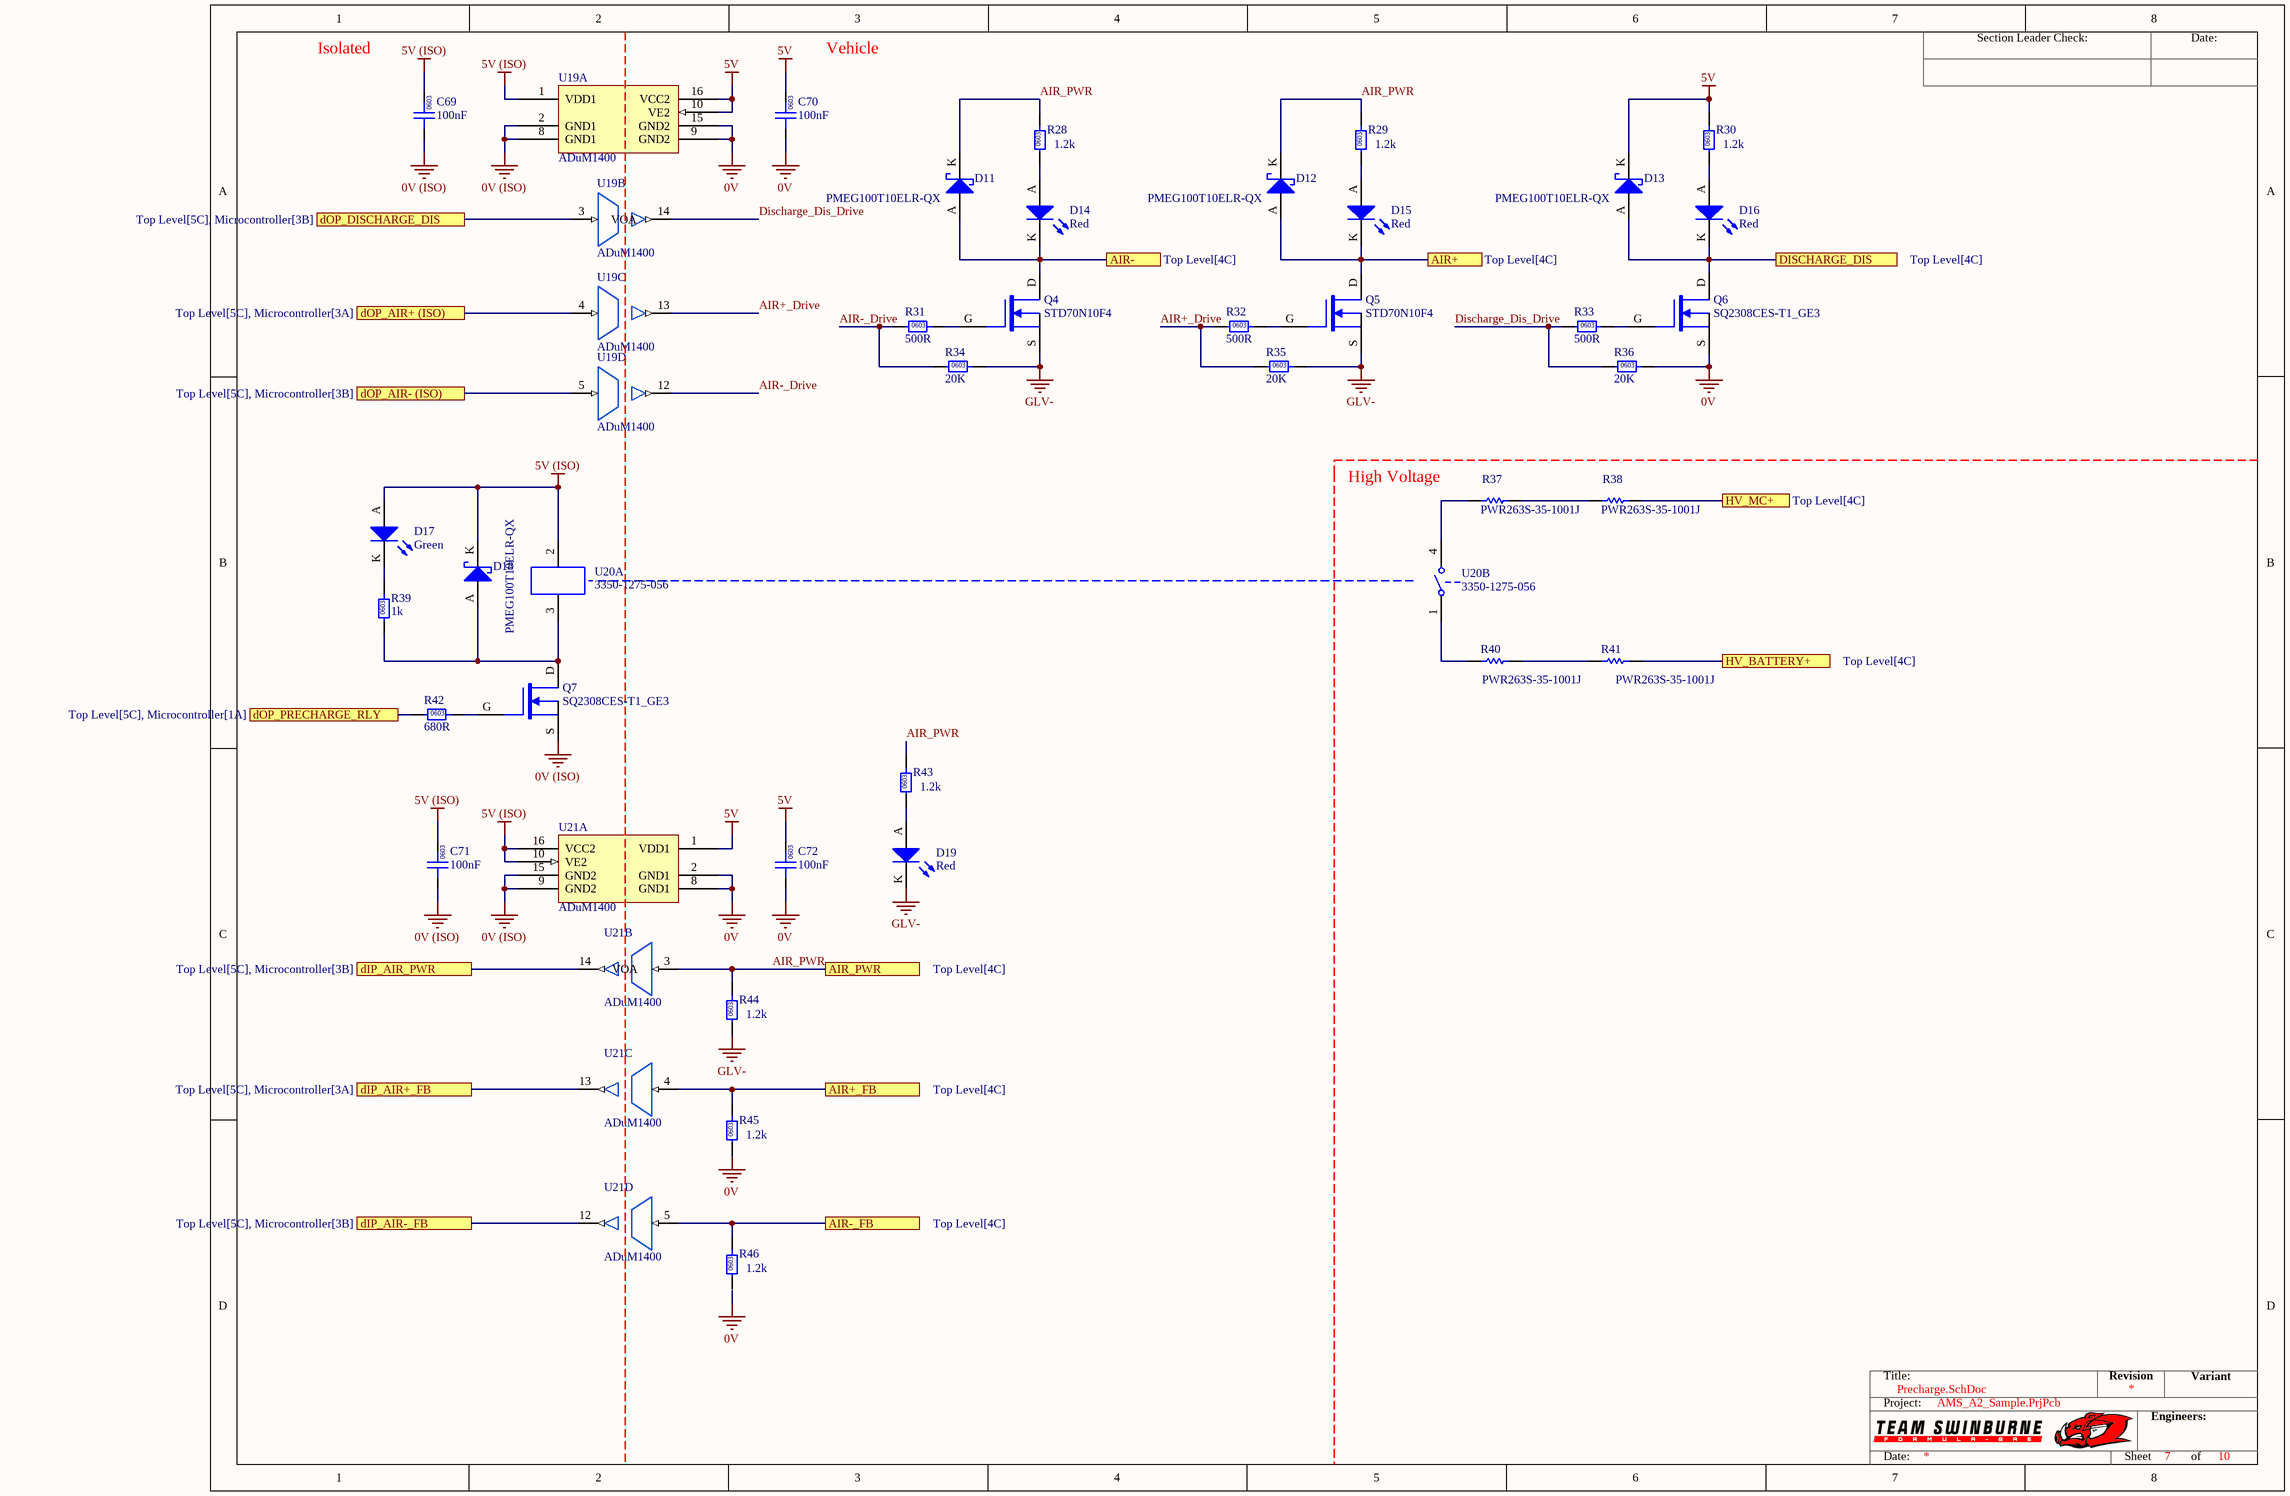
[diagram p3: Precharge.SchDoc]

### Parts
C69  100nF  [0603]
C70  100nF  [0603]
C71  100nF  [0603]
C72  100nF  [0603]
D11  PMEG100T10ELR-QX  [NXP SOD123W]
D12  PMEG100T10ELR-QX  [NXP SOD123W]
D13  PMEG100T10ELR-QX  [NXP SOD123W]
D14  Red  [0805 LED]
D15  Red  [0805 LED]
D16  Red  [0805 LED]
D17  Green  [0805 LED]
D18  PMEG100T10ELR-QX  [NXP SOD123W]
D19  Red  [0805 LED]
Q4  STD70N10F4  [STM TO-252 MOSFET]
Q5  STD70N10F4  [STM TO-252 MOSFET]
Q6  SQ2308CES-T1_GE3  [VSHY SOT-23-3]
Q7  SQ2308CES-T1_GE3  [VSHY SOT-23-3]
R28  1.2k  [0603]
R29  1.2k  [0603]
R30  1.2k  [0603]
R31  500R  [0603]
R32  500R  [0603]
R33  500R  [0603]
R34  20K  [0603]
R35  20K  [0603]
R36  20K  [0603]
R37  PWR263S-35-1001J  [B TO-263]
R38  PWR263S-35-1001J  [B TO-263]
R39  1k  [0603]
R40  PWR263S-35-1001J  [B TO-263]
R41  PWR263S-35-1001J  [B TO-263]
R42  680R  [0603]
R43  1.2k  [0603]
R44  1.2k  [0603]
R45  1.2k  [0603]
R46  1.2k  [0603]
U19  ADuM1400  [AD 16-SOIC]  (parts A,B,C,D of 5)
U20  3350-1275-056  [CI SPST]  (parts A,B of 2)
U21  ADuM1400  [AD 16-SOIC]  (parts A,B,C,D of 5)

### Ports
AIR+ (see Top Level[4C]), AIR+_FB (see Top Level[4C]), AIR- (see Top Level[4C]), AIR-_FB (see Top Level[4C]), AIR_PWR (see Top Level[4C]), dIP_AIR+_FB (see Top Level[5C], Microcontroller[3A]), dIP_AIR-_FB (see Top Level[5C], Microcontroller[3B]), dIP_AIR_PWR (see Top Level[5C], Microcontroller[3B]), DISCHARGE_DIS (see Top Level[4C]), dOP_AIR+ (ISO) (see Top Level[5C], Microcontroller[3A]), dOP_AIR- (ISO) (see Top Level[5C], Microcontroller[3B]), dOP_DISCHARGE_DIS (see Top Level[5C], Microcontroller[3B]), dOP_PRECHARGE_RLY (see Top Level[5C], Microcontroller[1A]), HV_BATTERY+ (see Top Level[4C]), HV_MC+ (see Top Level[4C])

### Nets
0V: C70.1 C72.1 Q6.S R36.2 R45.1 U19.9(GND2) U19.15(GND2) U21.2(GND1) U21.8(GND1)
0V (ISO): C69.1 C71.1 Q7.S U19.2(GND1) U19.8(GND1) U21.9(GND2) U21.15(GND2)
5V: C70.2 C72.2 D13.K R30.2 U19.10(VE2) U19.16(VCC2) U21.1(VDD1)
5V (ISO): C69.2 C71.2 D17.A D18.K U19.1(VDD1) U20.2 U21.10(VE2) U21.16(VCC2)
GLV-: D19.K Q4.S Q5.S R34.2 R35.2 R44.1
AIR+: D12.A D15.K Q5.D ; port AIR+
AIR+_Drive: R32.1 R35.1 U19.13(VOB)
AIR+_FB: R45.2 U21.4(VIB) ; port AIR+_FB
AIR-: D11.A D14.K Q4.D ; port AIR-
AIR-_Drive: R31.1 R34.1 U19.12(VOC)
AIR-_FB: R46.2 U21.5(VIC) ; port AIR-_FB
AIR_PWR: D11.K D12.K R28.2 R29.2 R43.2 R44.2 U21.3(VIA) ; port AIR_PWR
dIP_AIR+_FB: U21.13(VOB) ; port dIP_AIR+_FB
dIP_AIR-_FB: U21.12(VOC) ; port dIP_AIR-_FB
dIP_AIR_PWR: U21.14(VOA) ; port dIP_AIR_PWR
DISCHARGE DISABLE: D13.A D16.K Q6.D ; port DISCHARGE_DIS
Discharge_Dis_Drive: R33.1 R36.1 U19.14(VOA)
dOP_AIR+ (ISO): U19.4(VIB) ; port dOP_AIR+ (ISO)
dOP_AIR- (ISO): U19.5(VIC) ; port dOP_AIR- (ISO)
dOP_DISCHARGE_DIS: U19.3(VIA) ; port dOP_DISCHARGE_DIS
dOP_PRECHARGE_RLY: R42.1 ; port dOP_PRECHARGE_RLY
HV Battery+: R41.1 ; port HV_BATTERY+
HV MC+: R38.2 ; port HV_MC+
NetD14_A: D14.A R28.1
NetD15_A: D15.A R29.1
NetD16_A: D16.A R30.1
NetD17_K: D17.K R39.2
NetD18_A: D18.A Q7.D R39.1 U20.3
NetD19_A: D19.A R43.1
NetQ4_G: Q4.G R31.2
NetQ5_G: Q5.G R32.2
NetQ6_G: Q6.G R33.2
NetQ7_G: Q7.G R42.2
NetR37_1: R37.1 U20.4
NetR37_2: R37.2 R38.1
NetR40_1: R40.1 R41.2
NetR40_2: R40.2 U20.1

Not connected (* = marked no-connect by the designer): R46 1

### Notes on the sheet
- Isolated
- Vehicle
- (near R37) High Voltage
- Section Leader Check:
- Date:
- Title:
- Revision
- Variant
- Project:
- Engineers:
- Sheet
- of
- (in symbol GCM188L81H104KA57D) 0603
- (in symbol RC0603FR-071KL) 0603
- (in symbol RC0603FR-0720KL) 0603
- (in symbol RC0603JR-071K2L) 0603
- (in symbol RC0603JR-13680RL) 0603
- (in symbol RT0603BRD07500RL) 0603

### Library data of the parts
C69-C72 = GCM188L81H104KA57D: as C57 on sheet Microcontroller; Part Number: GCM188L81H104KA57D; Value: 100nF; Digikey Part Number: 490-6049-1-ND
D11-D13 D18 = PMEG100T10ELR-QX: Manufacturer: Nexperia USA Inc.; Forward Voltage: 0.75 V @ 1A; Breakdown Voltage: 100 V; Rated Power: 680 mW; Part Number: PMEG100T10ELR-QX; Digikey Part Number: 1727-PMEG100T10ELR-QXCT-ND
D14-D16 D19 = SML-210LTT86: as D23 on sheet Microcontroller; Part Number: SML-210LTT86; Colour: Red; Digikey Part Number: 511-1286-1-ND
D17 = SML-210FTT86: Green LED Indication - Discrete 1.75V 0805 (2012 Metric); Manufacturer: ROHM Semiconductor; Part Number: SML-210FTT86; Colour: Green; Digikey Part Number: 511-1285-1-ND; Digikey Link: https://www.digikey.com/product-detail/en/rohm-semiconductor/SML-210FTT86/511-1285-1-ND/637098
Q4 Q5 = STD70N10F4: N-Channel 100V 60A (Tc) 125W (Tc) Surface Mount DPAK; Manufacturer: STMicroelectronics; Published: 24-Mar-1999; LatestRevisionDate: 29-May-2009; LatestRevisionNote: IPC-7351 Footprint Added.; PackageVersion: Sep-2000; PackageReference: SOT-343; Publisher: Altium Limited; PackageDescription: 4-Pin SOT-343 Package 1.3 mm Pitch, 2.1 mm Lead Span; Part Number: STD70N10F4; Type: N-channel; Rated Power: 125W; Digikey Part Number: 497-8806-2-ND
Q6 Q7 = SQ2308CES-T1_GE3: MOSFET N-CH 60V 2.3A SOT23; Manufacturer: Vishay Siliconix; Type: N-channel; Rated Power: 2W; Published: 24-Mar-1999; LatestRevisionDate: 29-May-2009; LatestRevisionNote: IPC-7351 Footprint Added.; PackageVersion: Sep-2000; PackageReference: SOT-343; Publisher: Altium Limited; PackageDescription: 4-Pin SOT-343 Package 1.3 mm Pitch, 2.1 mm Lead Span; Part Number: SQ2308CES-T1_GE3; Digikey Part Number: SQ2308CES-T1_GE3CT-ND
R28-R30 R43-R46 = RC0603JR-071K2L: Manufacturer: YAGEO; Tolerance: 0.01; Rated Power: 0.1W; Part Number: RC0603JR-071K2L; Value: 1.2k; Material: FR-07; Digikey Part Number: 311-1.2KGRCT-ND
R31-R33 = RT0603BRD07500RL: Manufacturer: YAGEO; Tolerance: 0.01; Rated Power: 0.1W; Part Number: RT0603BRD07500RL; Value: 500R; Material: FR-07; Digikey Part Number: 13-RT0603BRD07500RL-ND
R34-R36 = RC0603FR-0720KL: as R26 on sheet PDOC; Part Number: RC0603FR-0720KL; Value: 20K; Material: FR-07; Digikey Part Number: 311-20.0KHRCT-ND
R37 R38 R40 R41 = CMP-037-000402-1: Manufacturer: Bournes Inc; Value: 1k; Rated Voltage: 35W; Tolerance: 0.05; Part Number: PWR263S-35-1001J; Digikey Part Number: PWR263S-35-1001J-ND
R39 = RC0603FR-071KL: as R61 on sheet Microcontroller; Part Number: RC0603FR-071KL; Value: 1k; Material: FR-07; Digikey Part Number: 311-1.00KHRCT-ND
R42 = RC0603JR-13680RL: Manufacturer: YAGEO; Tolerance: 0.01; Rated Power: 0.1W; Part Number: RC0603JR-13680RL; Value: 680R; Material: FR-07; Digikey Part Number: 13-RC0603JR-13680RLCT-ND
U19 U21 = ADuM1400: General Purpose Digital Isolator 2500Vrms 4 Channel 1Mbps 25kV/µs CMTI 16-SOIC (0.295", 7.50mm Width); Manufacturer: Analog Devices; Part Number: ADuM1400; Digikey Part Number: ADUM1400WSRWZ-ND; Digikey Link: https://www.digikey.com/product-detail/en/analog-devices-inc/ADUM1400WSRWZ/ADUM1400WSRWZ-ND/1873713
U20 = 3350-1275-056: RELAY REED HV SPST 200W 3A 5V (NO); Manufacturer: Comus International; Part Number: 3350-1275-056; Digikey Part Number: 1835-1036-ND; Digikey Link: https://www.digikey.com.au/product-detail/en/comus-international/3350-1275-056/1835-1036-ND/7515918

## Sheet Charge Interface.SchDoc
size A4; SheetNumber: 8; SheetTotal: 10
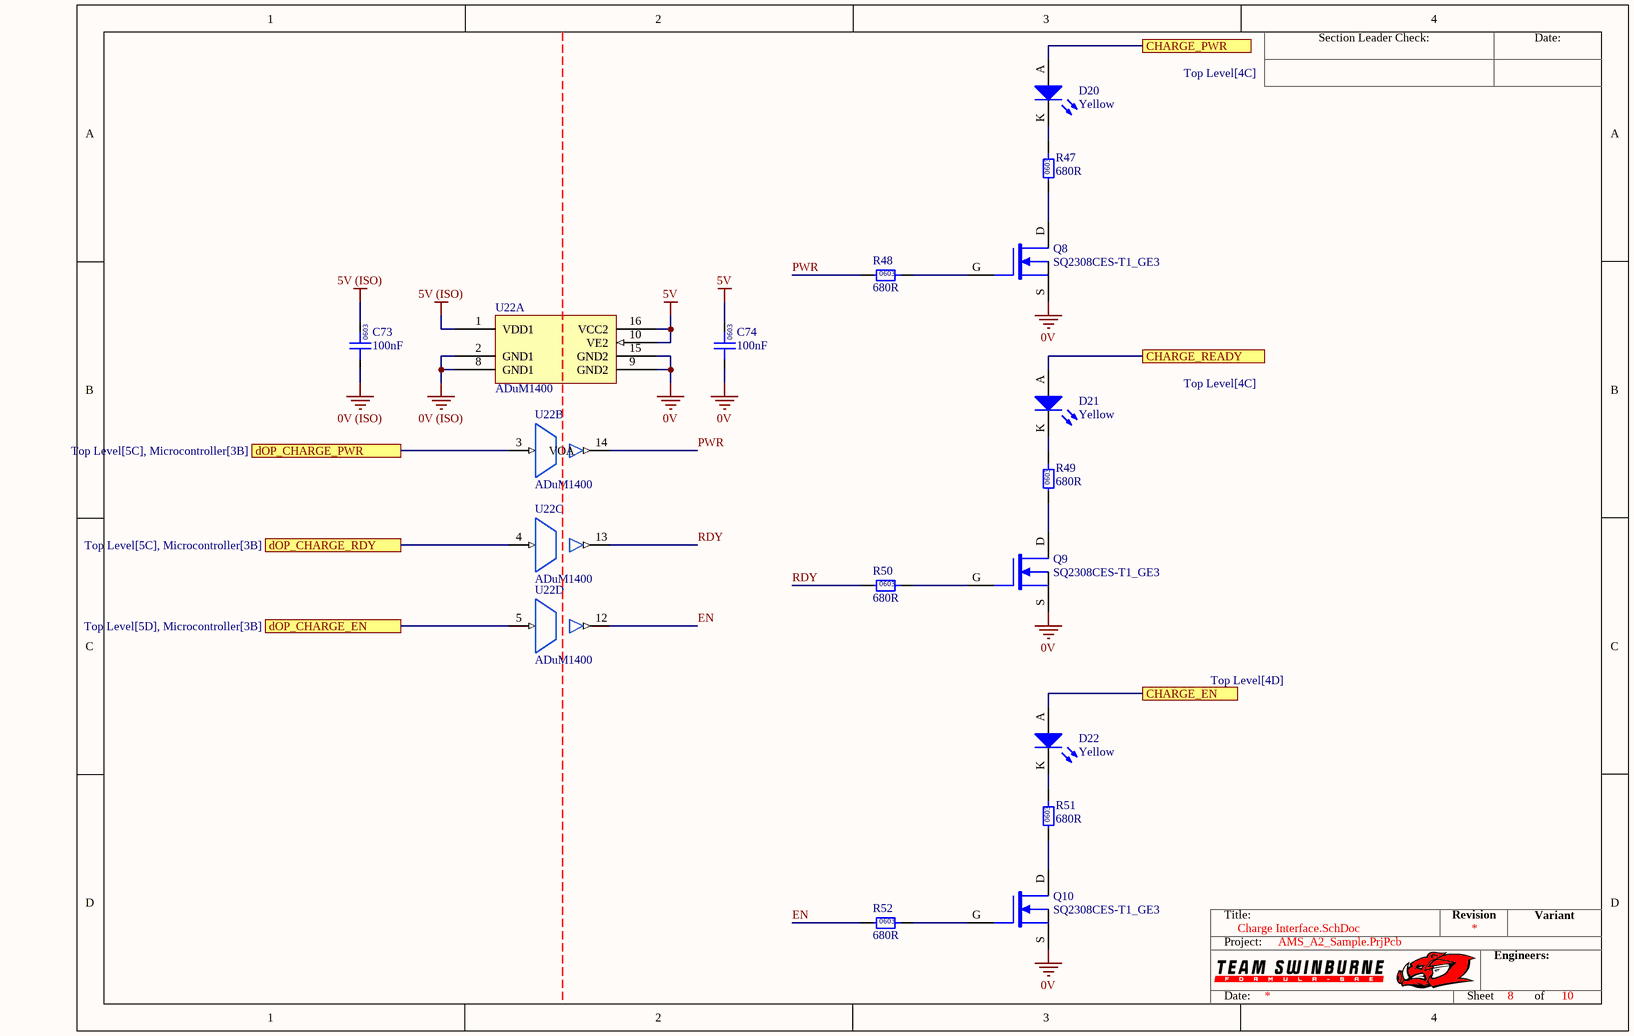
[diagram p4: Charge Interface.SchDoc]

### Parts
C73  100nF  [0603]
C74  100nF  [0603]
D20  Yellow  [0805 LED]
D21  Yellow  [0805 LED]
D22  Yellow  [0805 LED]
Q8  SQ2308CES-T1_GE3  [VSHY SOT-23-3]
Q9  SQ2308CES-T1_GE3  [VSHY SOT-23-3]
Q10  SQ2308CES-T1_GE3  [VSHY SOT-23-3]
R47  680R  [0603]
R48  680R  [0603]
R49  680R  [0603]
R50  680R  [0603]
R51  680R  [0603]
R52  680R  [0603]
U22  ADuM1400  [AD 16-SOIC]  (parts A,B,C,D of 5)

### Ports
CHARGE_EN (see Top Level[4D]), CHARGE_PWR (see Top Level[4C]), CHARGE_READY (see Top Level[4C]), dOP_CHARGE_EN (see Top Level[5D], Microcontroller[3B]), dOP_CHARGE_PWR (see Top Level[5C], Microcontroller[3B]), dOP_CHARGE_RDY (see Top Level[5C], Microcontroller[3B])

### Nets
0V: C74.1 Q8.S Q9.S Q10.S U22.9(GND2) U22.15(GND2)
0V (ISO): C73.1 U22.2(GND1) U22.8(GND1)
5V: C74.2 U22.10(VE2) U22.16(VCC2)
5V (ISO): C73.2 U22.1(VDD1)
Charge_En: D22.A ; port CHARGE_EN
Charge_PWR: D20.A ; port CHARGE_PWR
Charge_Ready: D21.A ; port CHARGE_READY
dOP_CHARGE_EN: U22.5(VIC) ; port dOP_CHARGE_EN
dOP_CHARGE_PWR: U22.3(VIA) ; port dOP_CHARGE_PWR
dOP_CHARGE_RDY: U22.4(VIB) ; port dOP_CHARGE_RDY
EN: R52.1 U22.12(VOC)
PWR: R48.1 U22.14(VOA)
RDY: R50.1 U22.13(VOB)
NetD20_K: D20.K R47.2
NetD21_K: D21.K R49.2
NetD22_K: D22.K R51.2
NetQ8_D: Q8.D R47.1
NetQ8_G: Q8.G R48.2
NetQ9_D: Q9.D R49.1
NetQ9_G: Q9.G R50.2
NetQ10_D: Q10.D R51.1
NetQ10_G: Q10.G R52.2

### Notes on the sheet
- Section Leader Check:
- Date:
- Title:
- Revision
- Variant
- Project:
- Engineers:
- Sheet
- of
- (in symbol GCM188L81H104KA57D) 0603
- (in symbol RC0603JR-13680RL) 0603

### Library data of the parts
C73 C74 = GCM188L81H104KA57D: as C57 on sheet Microcontroller; Part Number: GCM188L81H104KA57D; Value: 100nF; Digikey Part Number: 490-6049-1-ND
D20-D22 = SML-211YTT86: Yellow LED Indication - Discrete 1.75V 0805 (2012 Metric); Manufacturer: ROHM Semiconductor; Part Number: SML-211YTT86; Colour: Yellow; Digikey Part Number: 511-1293-1-ND
Q8-Q10 = SQ2308CES-T1_GE3: as Q6 on sheet Precharge; Published: 24-Mar-1999; LatestRevisionDate: 29-May-2009; LatestRevisionNote: IPC-7351 Footprint Added.; PackageVersion: Sep-2000; PackageReference: SOT-343; Publisher: Altium Limited; PackageDescription: 4-Pin SOT-343 Package 1.3 mm Pitch, 2.1 mm Lead Span; Part Number: SQ2308CES-T1_GE3; Digikey Part Number: SQ2308CES-T1_GE3CT-ND
R47-R52 = RC0603JR-13680RL: as R42 on sheet Precharge; Part Number: RC0603JR-13680RL; Value: 680R; Material: FR-07; Digikey Part Number: 13-RC0603JR-13680RLCT-ND
U22 = ADuM1400: as U19 on sheet Precharge; Part Number: ADuM1400; Digikey Part Number: ADUM1400WSRWZ-ND; Digikey Link: https://www.digikey.com/product-detail/en/analog-devices-inc/ADUM1400WSRWZ/ADUM1400WSRWZ-ND/1873713

## Sheet Current Sensor.SchDoc
size A4; SheetNumber: 9; SheetTotal: 9
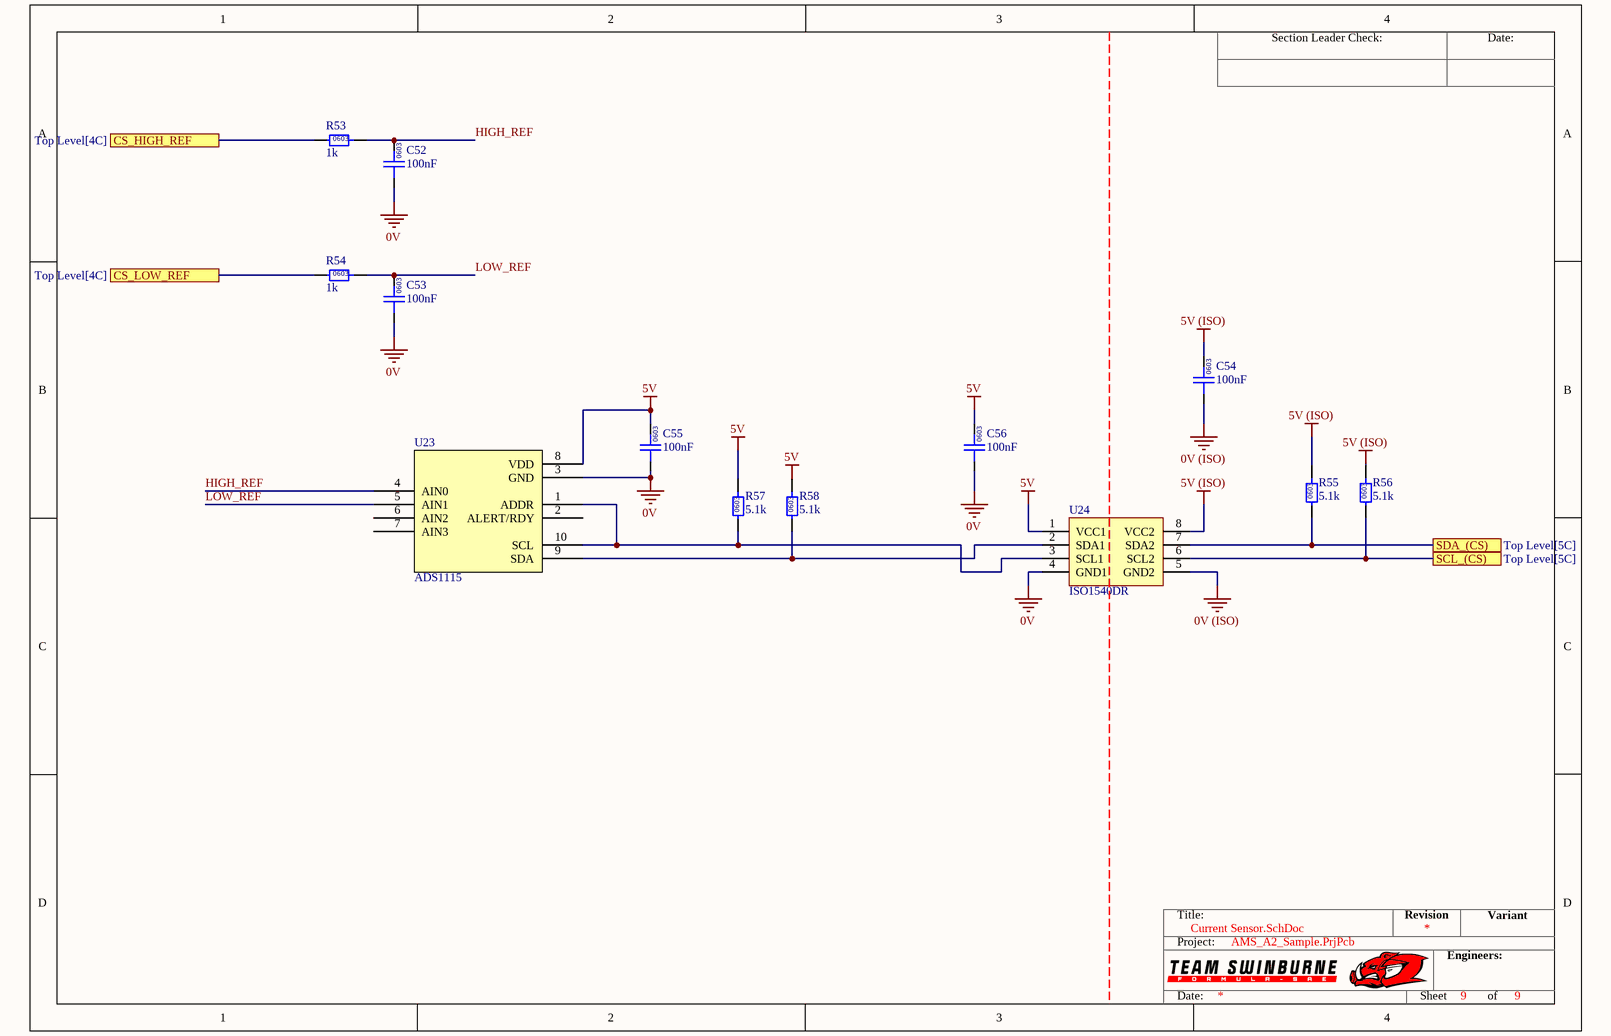
[diagram p5: Current Sensor.SchDoc]

### Parts
C52  100nF  [0603]
C53  100nF  [0603]
C54  100nF  [0603]
C55  100nF  [0603]
C56  100nF  [0603]
R53  1k  [0603]
R54  1k  [0603]
R55  5.1k  [0603]
R56  5.1k  [0603]
R57  5.1k  [0603]
R58  5.1k  [0603]
U23  ADS1115  [TI 10-VSSOP]
U24  ISO1540DR  [TI 8-SOIC]

### Ports
CS_HIGH_REF (see Top Level[4C]), CS_LOW_REF (see Top Level[4C]), SCL_(CS) (see Top Level[5C]), SDA_(CS) (see Top Level[5C])

### Nets
0V: C52.1 C53.1 C55.1 C56.1 U23.3(GND) U24.4(GND1)
0V (ISO): C54.1 U24.5(GND2)
5V: C55.2 C56.2 R57.2 R58.2 U23.8(VDD) U24.1(VCC1)
5V (ISO): C54.2 R55.2 R56.2 U24.8(VCC2)
H_REF: R53.1 ; port CS_HIGH_REF
HIGH_REF: C52.2 R53.2 U23.4(AIN0)
I2C3_SCL: R56.1 U24.6(SCL2) ; port SCL_(CS)
I2C3_SDA: R55.1 U24.7(SDA2) ; port SDA_(CS)
L_REF: R54.1 ; port CS_LOW_REF
LOW_REF: C53.2 R54.2 U23.5(AIN1)
NetR57_1: R57.1 U23.1(ADDR) U23.10(SCL) U24.3(SCL1)
NetR58_1: R58.1 U23.9(SDA) U24.2(SDA1)

Not connected (* = marked no-connect by the designer): U23 2(ALERT/RDY) 6(AIN2) 7(AIN3)

### Notes on the sheet
- Section Leader Check:
- Date:
- Title:
- Revision
- Variant
- Project:
- Engineers:
- Sheet
- of
- (in symbol GCM188L81H104KA57D) 0603
- (in symbol RC0603FR-071KL) 0603
- (in symbol RC0603JR-075K1L) 0603

### Library data of the parts
C52-C56 = GCM188L81H104KA57D: as C57 on sheet Microcontroller; Part Number: GCM188L81H104KA57D; Value: 100nF; Digikey Part Number: 490-6049-1-ND
R53 R54 = RC0603FR-071KL: as R61 on sheet Microcontroller; Part Number: RC0603FR-071KL; Value: 1k; Material: FR-07; Digikey Part Number: 311-1.00KHRCT-ND
R55-R58 = RC0603JR-075K1L: as R24 on sheet PDOC; Part Number: RC0603JR-075K1L; Value: 5.1k; Material: FR-07; Digikey Part Number: 311-5.1KGRCT-ND
U23 = ADS1115: as U17 on sheet PDOC; Part Number: ADS1115; Digikey Part Number: 296-38849-1-ND
U24 = ISO1540DR: I2C Digital Isolator (Multichannel); Manufacturer: Texas Instruments; Part Number: ISO1540DR; Digikey Part Number: 296-34871-1-ND; Digikey Link: https://www.digikey.com/product-detail/en/texas-instruments/ISO1540DR/296-34871-1-ND/3587214

## Sheet Power.SchDoc
size A3; SheetNumber: 2; SheetTotal: 7
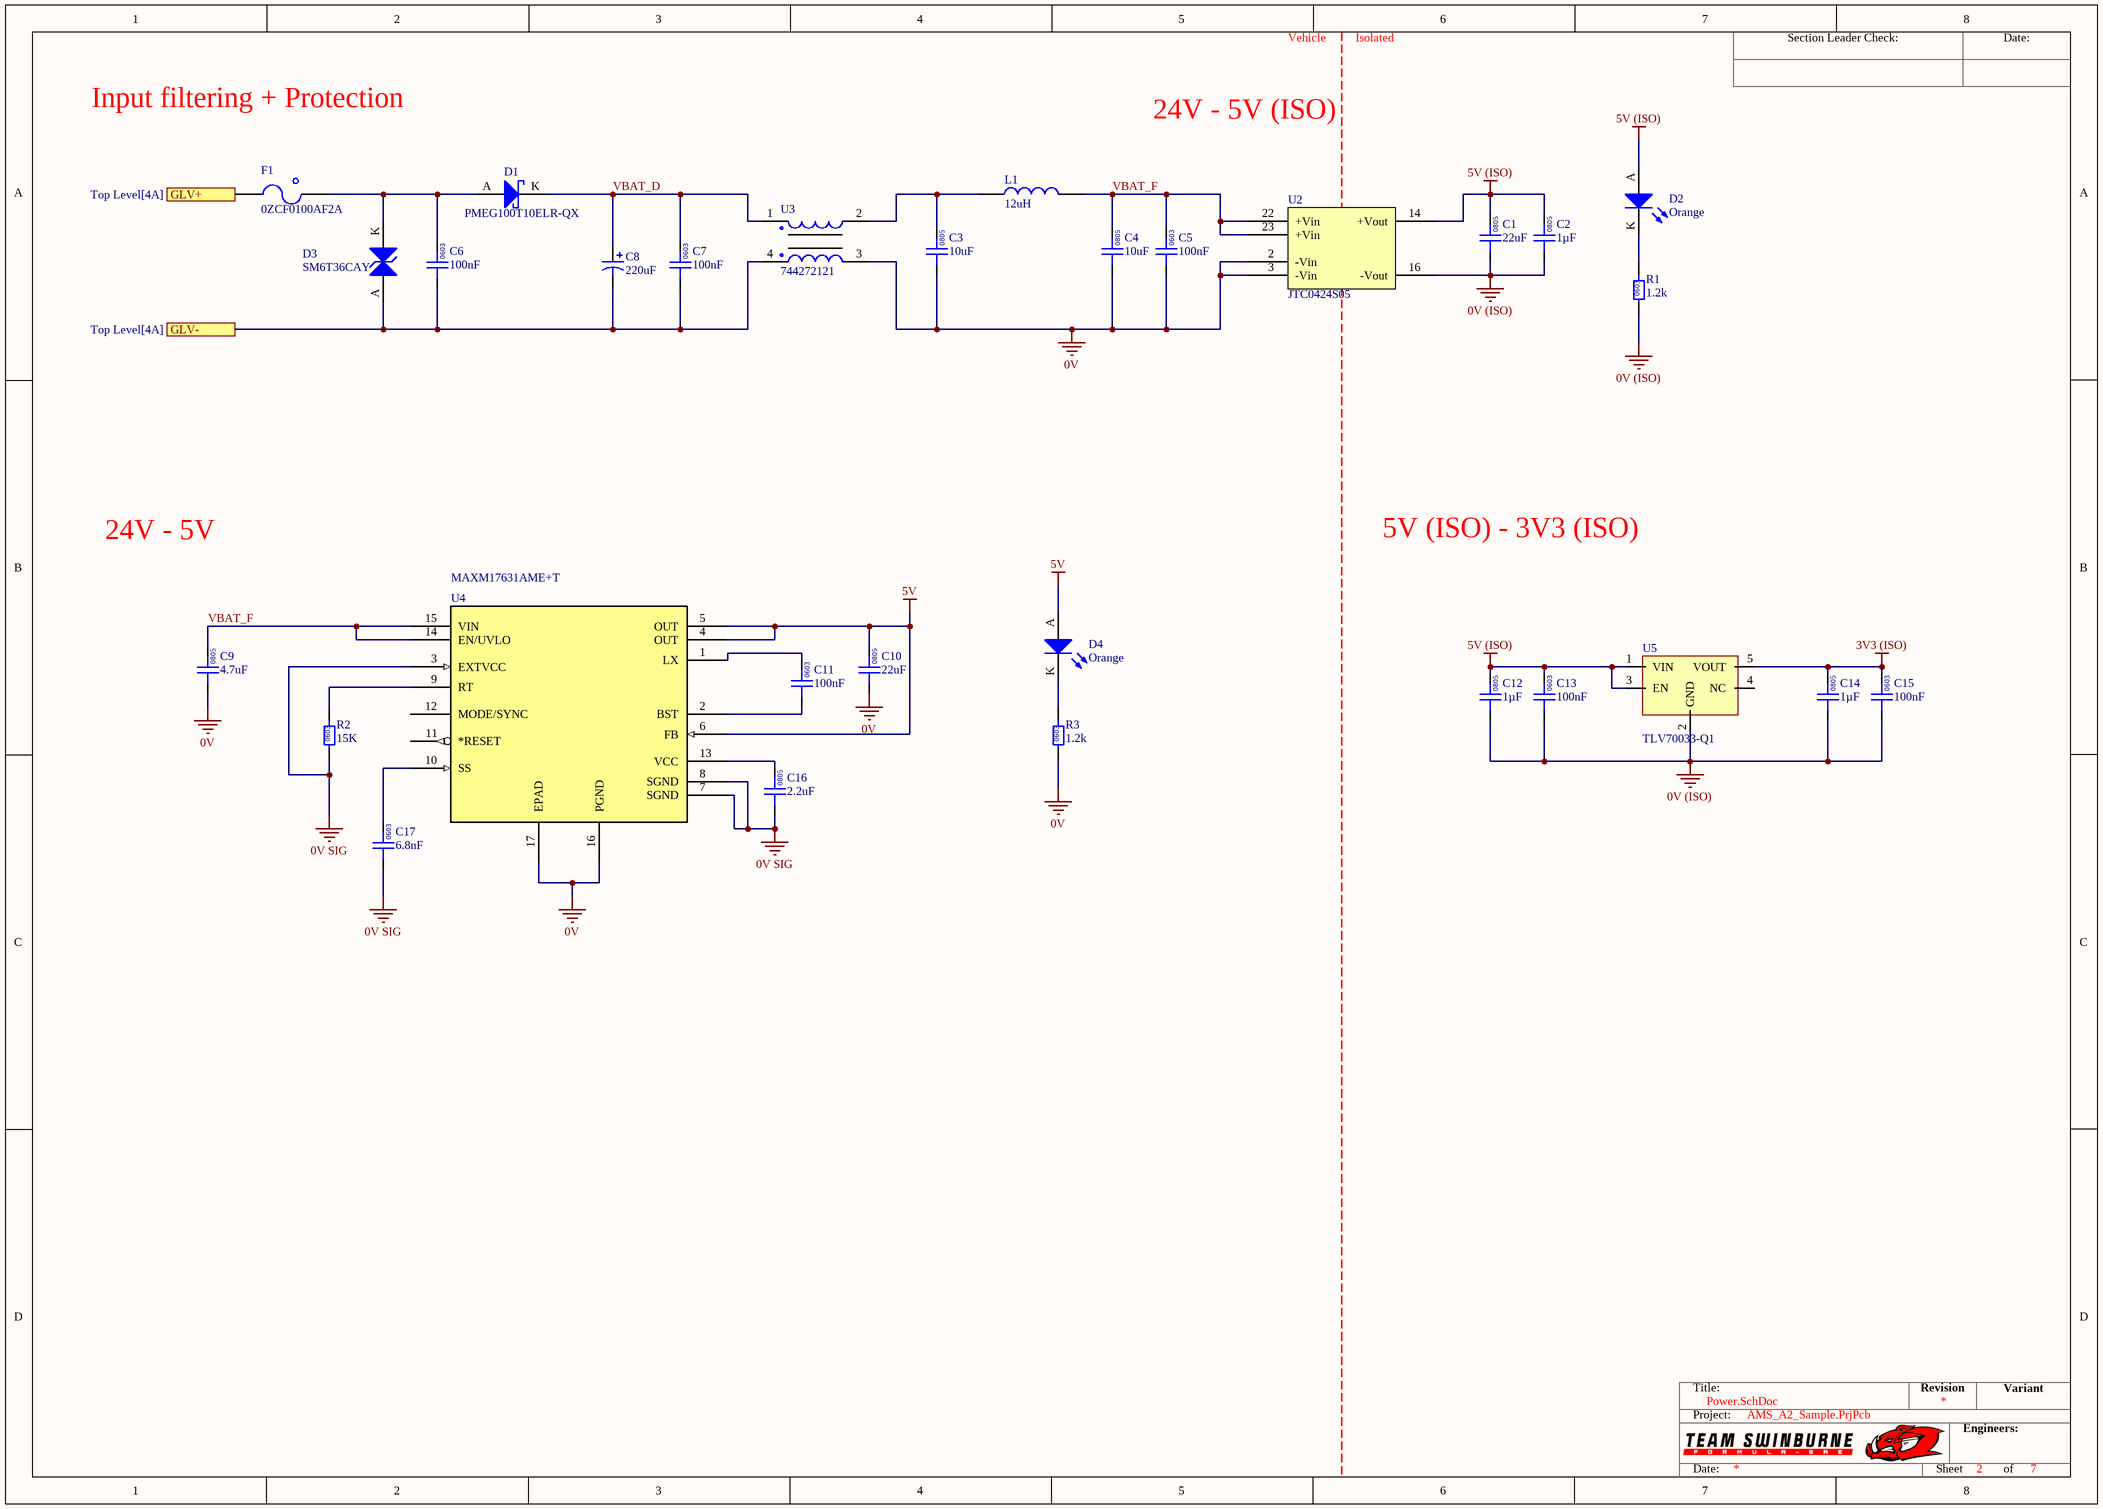
[diagram p6: Power.SchDoc]

### Parts
C1  22uF  [0805]
C2  1µF  [0805]
C3  10uF  [0805]
C4  10uF  [0805]
C5  100nF  [0603]
C6  100nF  [0603]
C7  100nF  [0603]
C8  220uF  [Vishay Radial 1213]
C9  4.7uF  [0805]
C10  22uF  [0805]
C11  100nF  [0603]
C12  1µF  [0805]
C13  100nF  [0603]
C14  1µF  [0805]
C15  100nF  [0603]
C16  2.2uF  [0805]
C17  6.8nF  [0603]
D1  PMEG100T10ELR-QX  [NXP SOD123W]
D2  Orange  [0805 LED]
D3  SM6T36CAY  [ST SMB DIODE]
D4  Orange  [0805 LED]
F1  0ZCF0100AF2A  [2920]
L1  12uH  [1812]
R1  1.2k  [0603]
R2  15K  [0603]
R3  1.2k  [0603]
U2  JTC0424S05  [24-DIP Module, 7 Leads]
U3  744272121  [Wurth 4-PC Pad]
U4  MAXM17631AME+T  [MAXM17631AME+T]
U5  TLV70033-Q1  [TI SOT-23-5]

### Ports
GLV+ (see Top Level[4A]), GLV- (see Top Level[4A])

### Nets
0V: C3.1 C4.1 C5.1 C9.1 C10.1 R3.1 U2.2(-Vin) U2.3(-Vin) U3.3 U4.16(PGND) U4.17(EPAD)
0V (ISO): C1.1 C2.1 C12.1 C13.1 C14.1 C15.1 R1.1 U2.16(-Vout) U5.2(GND)
0V SIG: C16.1 C17.1 R2.1 U4.3(EXTVCC) U4.7(SGND) U4.8(SGND)
3V3 (ISO): C14.2 C15.2 U5.5(VOUT)
5V: C10.2 D4.A U4.4(OUT) U4.5(OUT) U4.6(FB)
5V (ISO): C1.2 C2.2 C12.2 C13.2 D2.A U2.14(+Vout) U5.1(VIN) U5.3(EN)
GLV+: F1.1 ; port GLV+
GLV-: C6.1 C7.1 C8.1 D3.A U3.4 ; port GLV-
VBAT_D: C7.2 C8.2 D1.K U3.1
VBAT_F: C4.2 C5.2 C9.2 L1.1 U2.22(+Vin) U2.23(+Vin) U4.14(EN/UVLO) U4.15(VIN)
NetC3_2: C3.2 L1.2 U3.2
NetC6_2: C6.2 D1.A D3.K F1.2
NetC11_1: C11.1 U4.2(BST)
NetC11_2: C11.2 U4.1(LX)
NetC16_2: C16.2 U4.13(VCC)
NetC17_2: C17.2 U4.10(SS)
NetD2_K: D2.K R1.2
NetD4_K: D4.K R3.2
NetR2_2: R2.2 U4.9(RT)

Not connected (* = marked no-connect by the designer): U4 11(*RESET) 12(MODE/SYNC); U5 4(NC)

### Notes on the sheet
- Vehicle
- Isolated
- Input filtering + Protection
- 24V - 5V (ISO)
- 24V - 5V
- 5V (ISO) - 3V3 (ISO)
- Section Leader Check:
- Date:
- Title:
- Revision
- Variant
- Project:
- Engineers:
- Sheet
- of
- (in symbol ESR03EZPF1502) 0603
- (in symbol GCM21BR71H105KA03L) 0805
- (in symbol GCM188L81H104KA57D) 0603
- (in symbol GRM21BR6YA106KE43L) 0805
- (in symbol GRM21BR61A226ME51L) 0805
- (in symbol GRM21BR71E225KE11L) 0805
- (in symbol GRM1885C1H682JA01D) 0603
- (in symbol RC0603JR-071K2L) 0603

### Library data of the parts
C1 C10 = GRM21BR61A226ME51L: Manufacturer: muRata; Rated Voltage: 10V; Tolerance: 20%; Material: MLCC; Temperature Rating: X5R; Part Number: GRM21BR61A226ME51L; Value: 22uF; Digikey Part Number: 490-10511-1-ND
C2 C12 C14 = GCM21BR71H105KA03L: Manufacturer: muRata; Rated Voltage: 50V; Tolerance: ±10%; Material: MLCC; Temperature Rating: X7R; Part Number: GCM21BR71H105KA03L; Value: 1µF; Digikey Part Number: 490-10675-1-ND
C3 C4 = GRM21BR6YA106KE43L: as C45 on sheet PDOC; Part Number: GRM21BR6YA106KE43L; Value: 10uF; Digikey Part Number: 490-10514-6-ND
C5-C7 C11 C13 C15 = GCM188L81H104KA57D: as C57 on sheet Microcontroller; Part Number: GCM188L81H104KA57D; Value: 100nF; Digikey Part Number: 490-6049-1-ND
C8 = MAL214699106E3: Manufacturer: Vishay; Rated Voltage: 50V; Tolerance: 20%; Material: Aluminium Electrolytic; Temperature Rating: 125C; Part Number: MAL214699106E3; Value: 220uF; Digikey Part Number: 4440PHCT-ND
C9 = GRM21BR71E225KE11L: Manufacturer: Murata Electronics; Value: 2.2uF; Rated Voltage: 25V; Tolerance: ±10%; Material: MLCC; Temperature Rating: X7R; Part Number: GRM21BR71E225KE11L; Digikey Part Number: 490-14467-2-ND
C16 = GRM21BR71E225KE11L: as C63 on sheet Microcontroller; Part Number: GRM21BR71E225KE11L; Value: 2.2uF; Digikey Part Number: 490-14467-2-ND
C17 = GRM1885C1H682JA01D: Manufacturer: Murata Electronics; Rated Voltage: 50V; Tolerance: ±5%; Material: MLCC; Temperature Rating: C0G, NP0; Part Number: GRM1885C1H682JA01D; Value: 6.8nF; Digikey Part Number: 490-11477-1-ND
D1 = PMEG100T10ELR-QX: as D11 on sheet Precharge; Part Number: PMEG100T10ELR-QX; Digikey Part Number: 1727-PMEG100T10ELR-QXCT-ND
D2 D4 = SML-211DTT86: Orange LED Indication - Discrete 1.75V 0805 (2012 Metric); Manufacturer: ROHM Semiconductor; Part Number: SML-211DTT86; Colour: Orange; Digikey Part Number: 511-1291-1-ND
D3 = SM6T36CAY: Manufacturer: STMicroelectronics; Forward Voltage: 30.8 V; Rated Power: 600W; Part Number: SM6T36CAY; Breakdown Voltage: 30.8 V; Digikey Part Number: 497-10804-1-ND
F1 = 0ZCF0100AF2A: PTC RESET FUSE 60V 1A 292; Manufacturer: Littelfuse Inc.; Part Number: 0ZCF0100AF2A; Digikey Part Number: 507-2070-1-ND; Digikey Link: https://www.digikey.com/product-detail/en/bel-fuse-inc/0ZCF0100AF2A/507-2070-1-ND/6210547
L1 = RLS-126: Manufacturer: Recom; Tolerance: 0.2; Impedance: 230mOhm; Rated Current: 0.8 A; Material: Wirewound; Part Number: RLS-126; Value: 12uH; Digikey Part Number: 945-3429-ND
R1 R3 = RC0603JR-071K2L: as R28 on sheet Precharge; Part Number: RC0603JR-071K2L; Value: 1.2k; Material: FR-07; Digikey Part Number: 311-1.2KGRCT-ND
R2 = ESR03EZPF1502: Manufacturer: Rohm Semiconductor; Tolerance: 0.01; Rated Power: 0.25W; Part Number: ESR03EZPF1502; Value: 15K; Material: FR-07; Digikey Part Number: RHM15.0KADCT-ND
U2 = JTC0424S05: DC DC CONVERTER 5V 4W; Manufacturer: XP Power; Input Voltage: 9V-36V; Efficiency: 0.79; Isolation: Isolated; Part Number: JTC0424S05; Output Voltage: 5V; Output Power: 4W; Digikey Part Number: JTC0424S05-ND; Digikey Link: https://www.digikey.com/products/en?keywords=%20JTC0424S05
U3 = 744272121: Manufacturer: Wurth Electronics Inc; Value: 120uH @ 100kHz; Impedance: 460 Ohms @ 30MHz; Rated Current: 2.5 A; Part Number: 744272121; Material: Wirewound; Digikey Part Number: 732-1489-1-ND
U4 = MAXM17631AME+T: DC DC CONVERTER 5V; Mfr_Name: Analog Devices Inc; Manufacturer: Analog Devices; Input Voltage: 4.5 to 36 V; Output Current: 1.0 A; Digi-Key_Part_Number_1: 175-MAXM17631AME+TTR-ND; RefDes: RefDes; Type: Type; Part Number: MAXM17631AME+T; Output Voltage: 5V; Digikey Part Number: 175-MAXM17631AME+TTR-ND
U5 = TLV70033-Q1: IC REG LINEAR 3.3V 200MA SOT23-5; Manufacturer: Texas Instruments; Input Voltage: 2 to 5.5 V; Output Current: 0.2 A; Part Number: TLV70033-Q1; Output Voltage: 3.3 V; Digikey Part Number: 296-27780-1-ND

## Nets that join several sheets
0V: Top Level (P3.2 P14.4), Precharge (9 pins), Charge Interface (6 pins), Current Sensor (6 pins), Power (11 pins)
0V (ISO): Microcontroller (20 pins), PDOC (12 pins), Precharge (7 pins), Charge Interface (C73.1 U22.2 U22.8), Current Sensor (C54.1 U24.5), Power (9 pins)
3V3 (ISO): Microcontroller (18 pins), Power (C14.2 C15.2 U5.5)
5V: Top Level (P5.5 P5.7 P14.2), Precharge (7 pins), Charge Interface (C74.2 U22.10 U22.16), Current Sensor (6 pins), Power (5 pins)
5V (ISO): PDOC (8 pins), Precharge (8 pins), Charge Interface (C73.2 U22.1), Current Sensor (C54.2 R55.2 R56.2 U24.8), Power (8 pins)
GLV+: Top Level (P1.12 P3.1), Power (F1.1)
GLV-: Top Level (P1.1 P1.11), Precharge (6 pins), Power (5 pins)
AIR+: Top Level (P5.4), Precharge (D12.A D15.K Q5.D)
AIR+_FB: Top Level (P5.6), Precharge (R45.2 U21.4)
AIR-: Top Level (P5.2), Precharge (D11.A D14.K Q4.D)
AIR-_FB: Top Level (P5.8), Precharge (R46.2 U21.5)
AIR_PWR: Top Level (P2.1 P5.1 P5.3), Precharge (7 pins)
Charge_En: Top Level (P2.3), Charge Interface (D22.A)
Charge_PWR: Top Level (P2.5), Charge Interface (D20.A)
Charge_Ready: Top Level (P2.4), Charge Interface (D21.A)
dIP_AIR+_FB: Microcontroller (U25.27), Precharge (U21.13)
dIP_AIR-_FB: Microcontroller (U25.25), Precharge (U21.12)
dIP_AIR_PWR: Microcontroller (U25.29), Precharge (U21.14)
dIP_PDOC_OK: Microcontroller (U25.14), PDOC (U15.6)
DISCHARGE DISABLE: Top Level (P2.2), Precharge (D13.A D16.K Q6.D)
dOP_AIR+ (ISO): Microcontroller (U25.26), Precharge (U19.4)
dOP_AIR- (ISO): Microcontroller (U25.24), Precharge (U19.5)
dOP_CHARGE_EN: Microcontroller (U25.37), Charge Interface (U22.5)
dOP_CHARGE_PWR: Microcontroller (U25.39), Charge Interface (U22.3)
dOP_CHARGE_RDY: Microcontroller (U25.38), Charge Interface (U22.4)
dOP_DISCHARGE_DIS: Microcontroller (U25.28), Precharge (U19.3)
dOP_PRECHARGE_RLY: Microcontroller (U25.15), Precharge (R42.1)
H_REF: Top Level (P14.3), Current Sensor (R53.1)
HV Battery+: Top Level (P7.1 P7.2 P8.1 P8.2), Precharge (R41.1)
HV MC+: Top Level (P6.1 P6.2 P9.1 P9.2), Precharge (R38.2)
I2C1_SCL: Microcontroller (U25.58), PDOC (U18.2)
I2C1_SDA: Microcontroller (U25.59), PDOC (U18.3)
I2C3_SCL: Microcontroller (U25.41), Current Sensor (R56.1 U24.6)
I2C3_SDA: Microcontroller (U25.40), Current Sensor (R55.1 U24.7)
L_REF: Top Level (P14.1), Current Sensor (R54.1)